# EAGLE board Open-Source_Control_V3_R0 (EAGLE 9.6.2), part 1 of 2
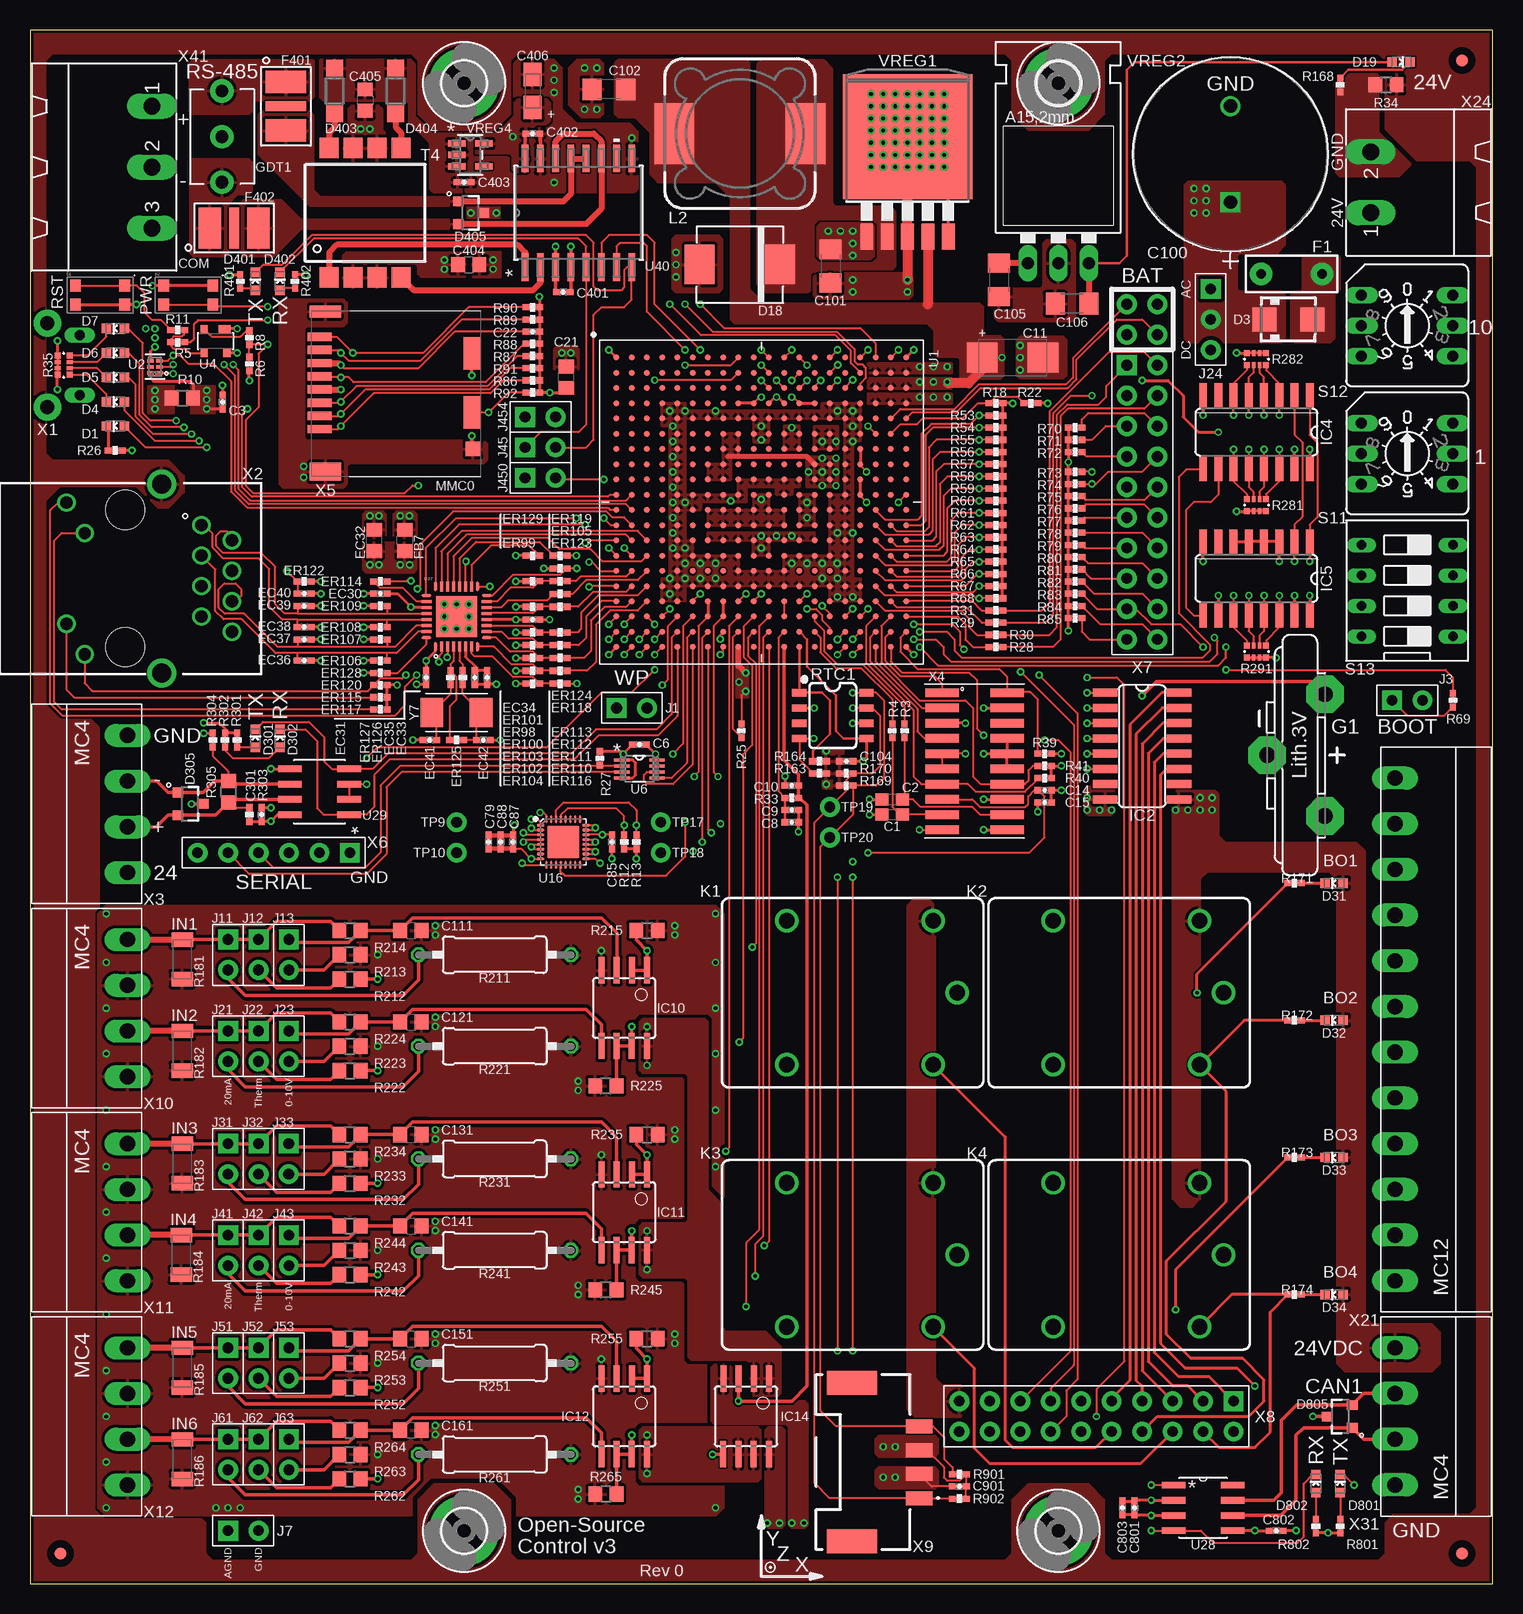
[diagram p7: board, top side]
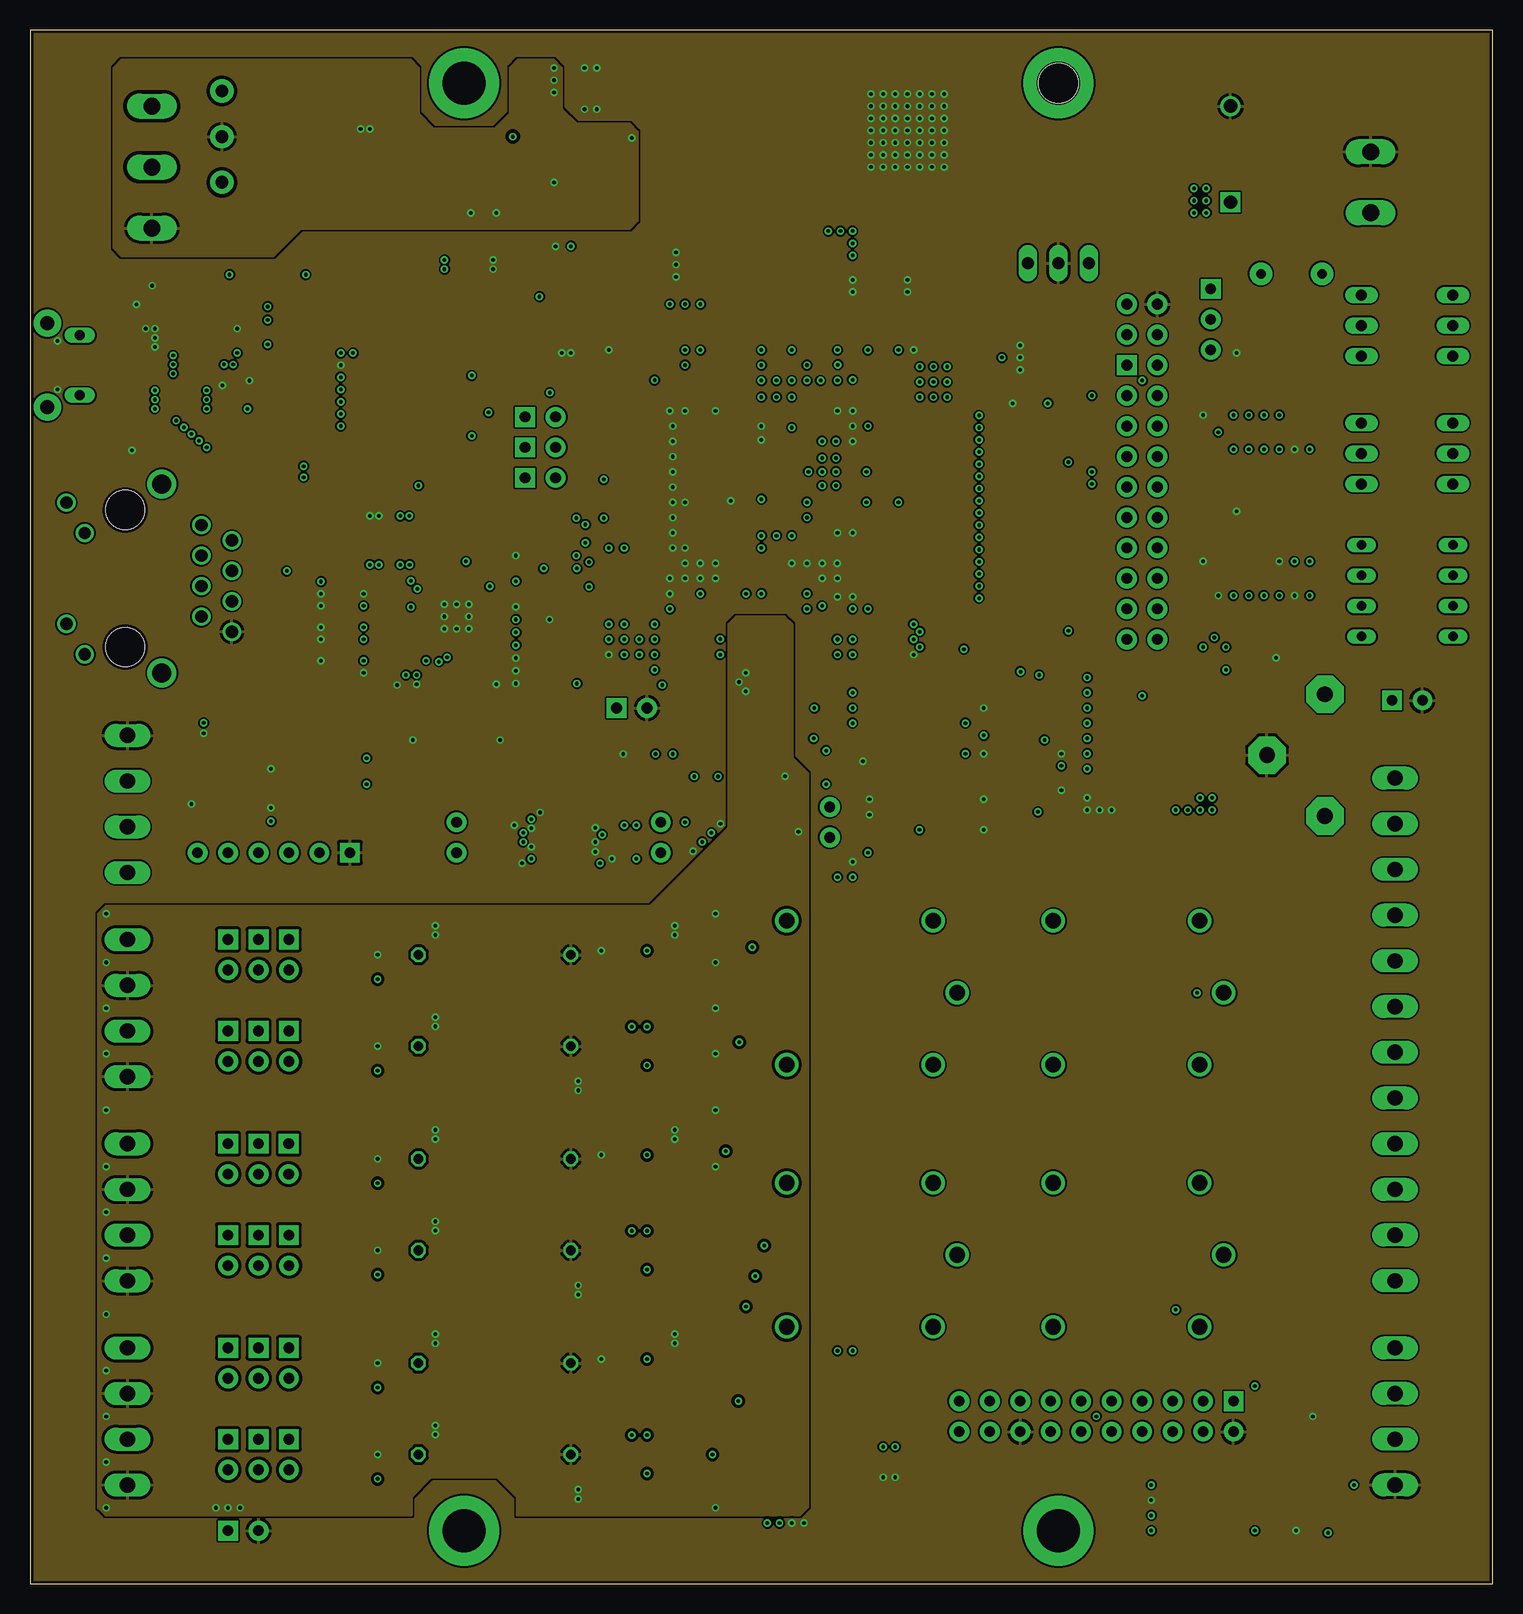
[diagram p8: board, inner layer Route2]
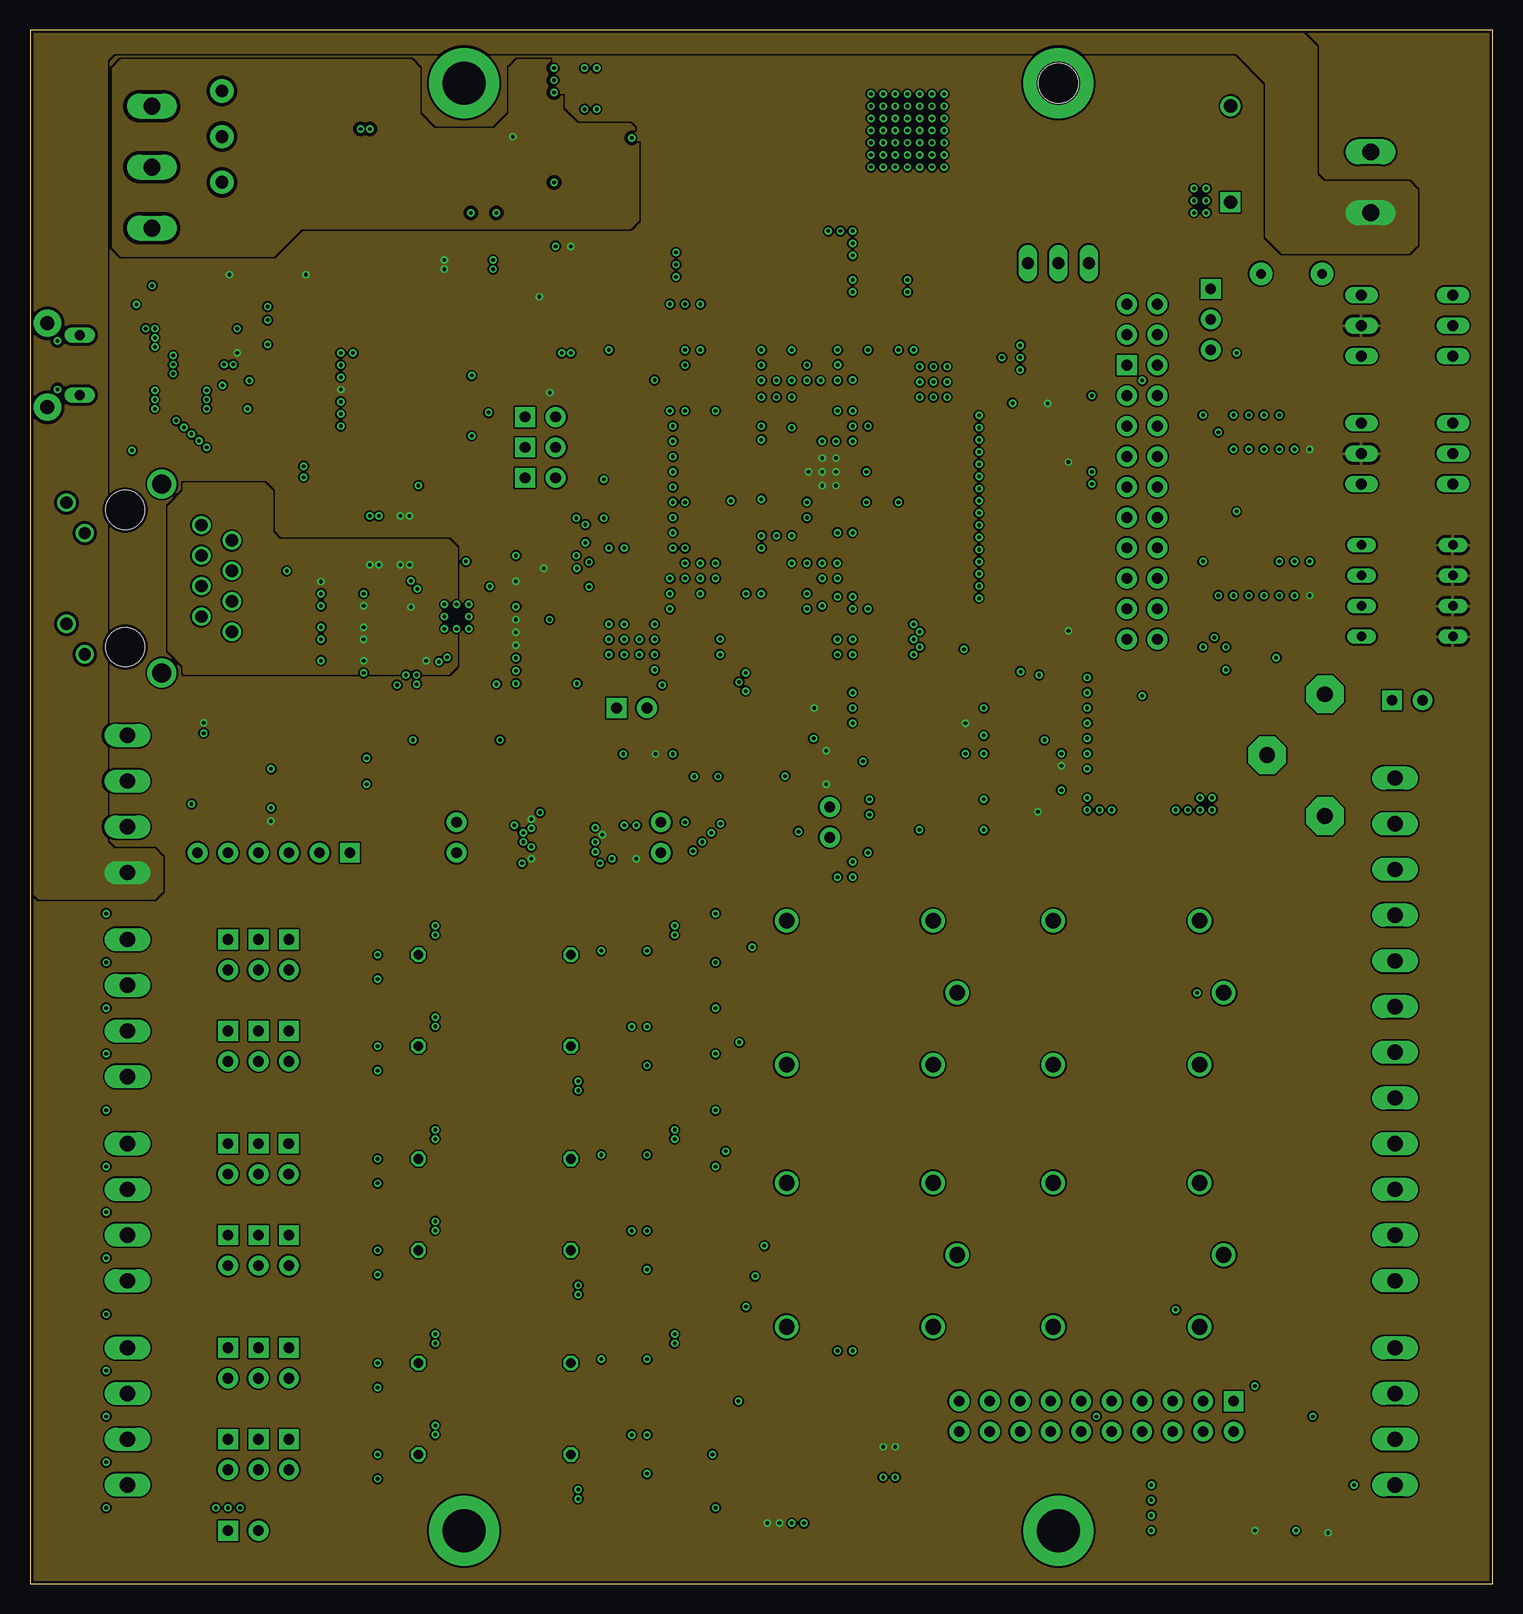
[diagram p9: board, inner layer Route15]
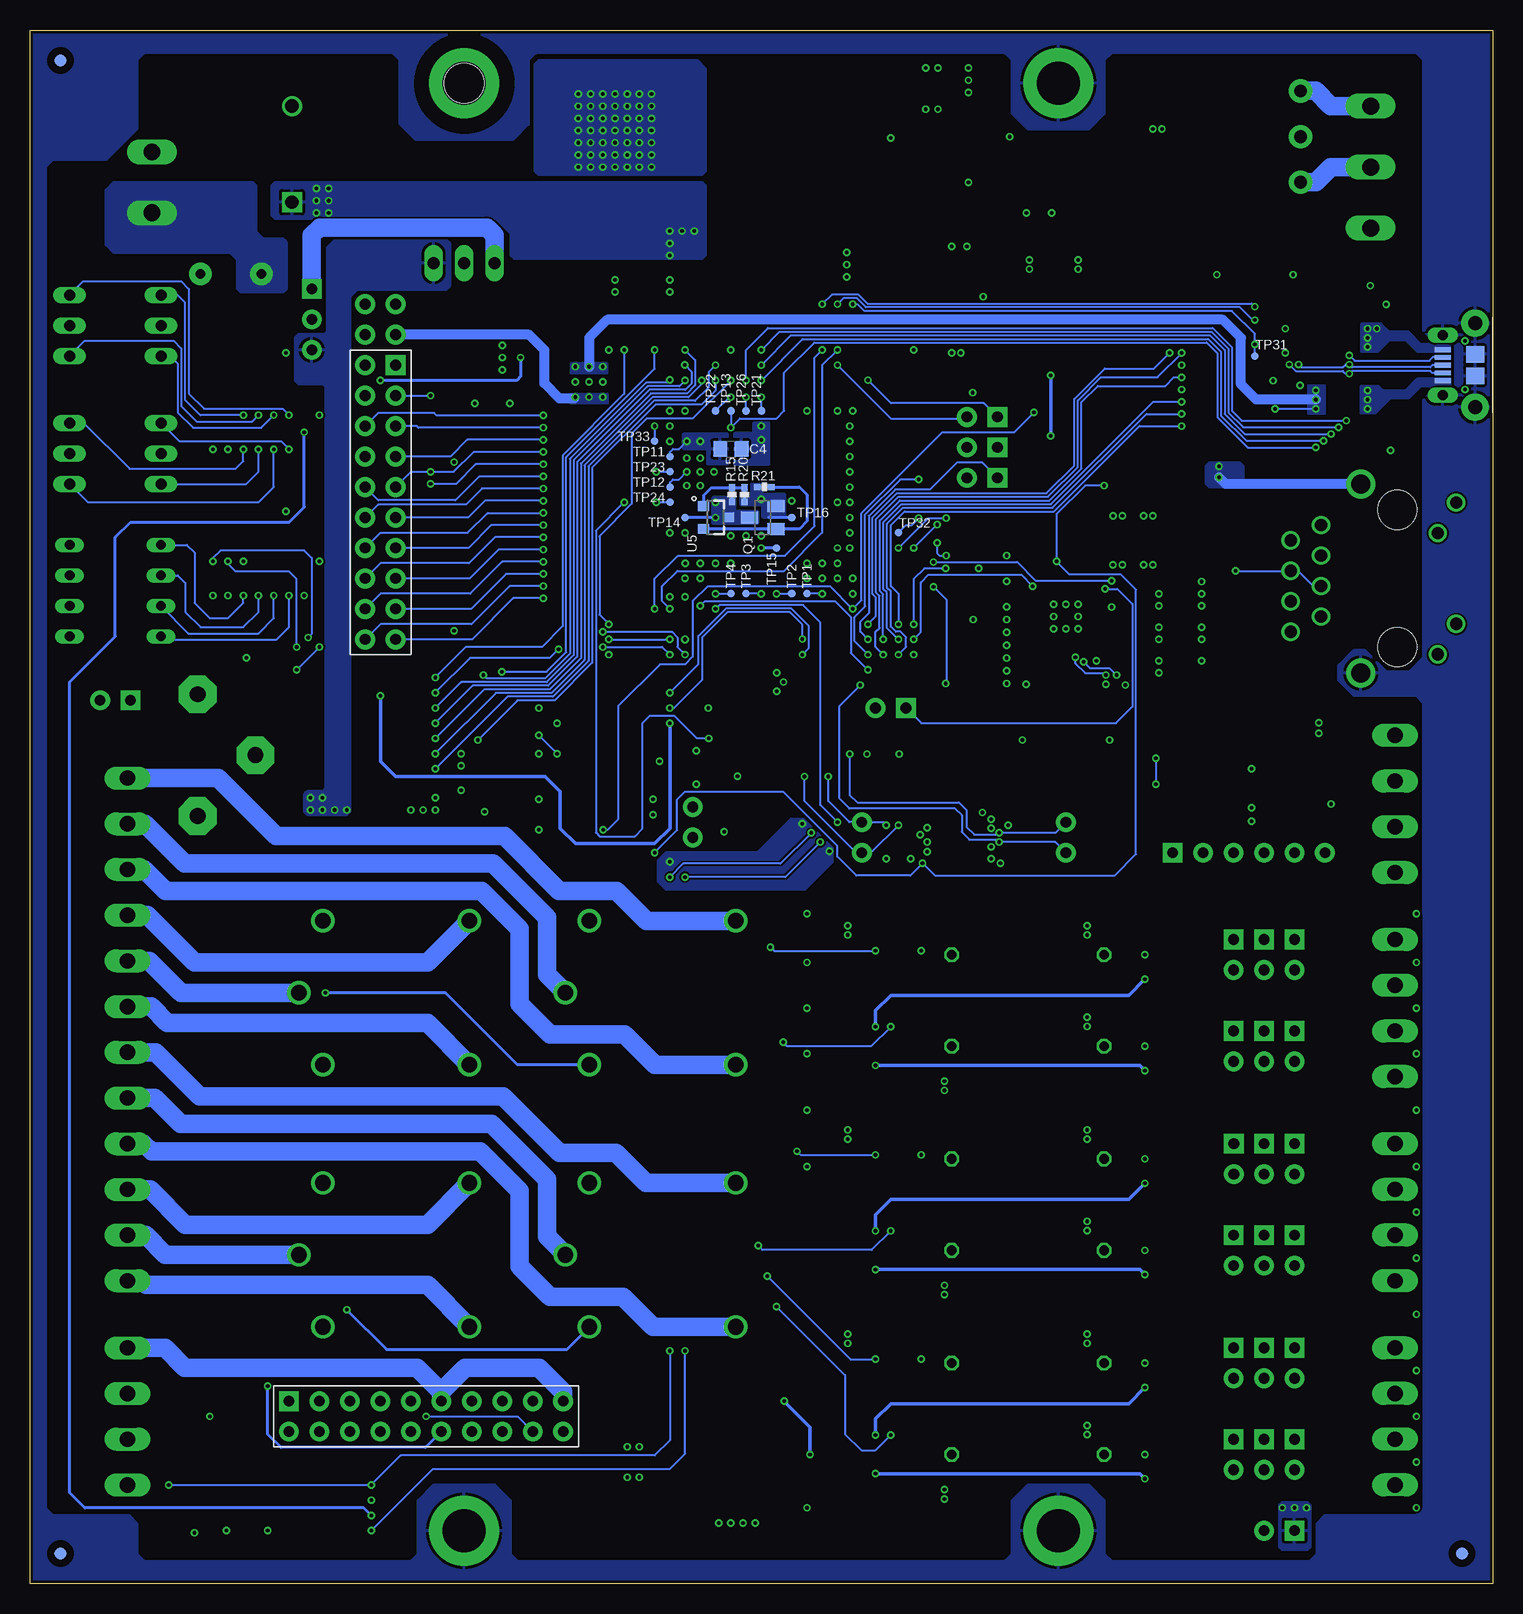
[diagram p10: board, bottom side, seen from below]

Size 121.92 x 129.54 mm. Coordinates in mm from the lower left corner, seen from the top.
Outline: 0,0 121.92,0 121.92,129.54 0,129.54 0,0
Copper layers (1*2*15*16): Top 0.035mm / dielectric 0.23mm / Route2 0.035mm / dielectric 0.93mm / Route15 0.035mm / dielectric 0.23mm / Bottom 0.035mm
Design rules "MF_Standard_4_Layer *": minimum track width 6mil, minimum drill 12mil, track to track 6mil, track to pad 6mil, pad to pad 6mil, via to via 6mil, smd to smd 0mil, copper to edge 10mil, drill to drill 10mil, minimum pad ring 6mil, minimum via ring 6mil, stop-mask expansion 2mil, vias tented up to drill 25mil, thermal gap 10mil
Net classes: 0 default: width 0.127 mm, drill 0.254 mm; 1 ground: width 0.152 mm, drill 0.254 mm, clearance 0.152 mm

## Footprints (pad centres in the part's own frame; a part is rotated, then mirrored left to right if it is on the bottom)
C0603 = smd 1.1 x 1: 1 -0.85,0; 2 0.85,0
C0402 = smd 0.61 x 0.508: 1 -0.559,0; 2 0.559,0
C0805 = smd 1.143 x 1.27: 1 -0.889,0; 2 0.889,0
C/6032-28R = smd 2.55 x 2.5: + 2.525,0; - -2.525,0
PCAP_16X25-THRU-ELECT = drill 1.118 pad 1.524 square: 1 -8.001,0 | drill 1.118 pad 1.524: 2 0,0
1206 = smd 1.6 x 1.8: 1 -1.4,0; 2 1.4,0
A/3216-18R = smd 1.95 x 1.5: + 1.375,0; - -1.375,0
EIA-STD = smd 0.787 x 0.787: 1 -0.749,0; 2 0.749,0
SMA = smd 2 x 2: A 2,0; C -2,0
SMC = smd 2.5 x 3.3: A 3.35,0; C -3.35,0
SOT23-3 = smd 0.8 x 0.9: 1 -0.95,-1; 2 0.95,-1; 3 0,1.1
SOD123 = smd 1.4 x 1.4: A 1.9,0; C -1.9,0
R0402 = smd 0.61 x 0.508: 1 -0.559,0; 2 0.559,0
PTH = drill 0.8 pad 1.88: P$1 -2.54,0; P$2 2.54,0
TBU-CA = smd 1.88 x 3.404: 1 -2.032,0; 3 2.032,0 | smd 0.813 x 3.404: 2 0,0
FIDUCIAL_40MIL = smd 1.016 x 1.016: P$1 0,0
CR2032V = drill 1.321 pad 3.15 octagon: + -2.54,-5.08; +@1 -2.54,5.08; - 2.286,0
2036-XX-B3 = drill 1.067 pad 1.93: 1 0,-3.81; 2 0,3.81; 3 0,0
SO16 = smd 0.66 x 2.032: 1 -4.445,-3.073; 2 -3.175,-3.073; 3 -1.905,-3.073; 4 -0.635,-3.073; 5 0.635,-3.073; 6 1.905,-3.073; 7 3.175,-3.073; 8 4.445,-3.073; 9 4.445,3.073; 10 3.175,3.073; 11 1.905,3.073; 12 0.635,3.073; 13 -0.635,3.073; 14 -1.905,3.073; 15 -3.175,3.073; 16 -4.445,3.073
SOIC8 = smd 0.5 x 2.2: 1 -1.905,-3.154; 2 -0.645,-3.154; 3 0.625,-3.154; 4 1.895,-3.154; 5 1.905,3.154; 6 0.635,3.154; 7 -0.635,3.154; 8 -1.905,3.154
H2-2.54 = drill 0.889 pad 1.651 square: 1 0,1.27 | drill 0.889 pad 1.651: 2 0,-1.27
H3-2.54 = drill 0.889 pad 1.651 square: 1 0,2.54 | drill 0.889 pad 1.651: 2 0,0; 3 0,-2.54
JS-M = drill 1.3: 1 6.7,6; 2 6.7,-6; C 8.7,0; NC -5.5,-6; NO -5.5,6
SRP1265 = smd 5.08 x 3.302: 1 0,5.461; 2 0,-5.461
3,6-PAD = drill 3.6 pad 5.842: B3,6 0,0
SOT23-BEC = smd 1 x 1.4: B -0.95,-1.1; C 0,1.1; E 0.95,-1.1
R0805 = smd 1.143 x 1.27: 1 -0.889,0; 2 0.889,0
RN0804 = smd 0.498 x 0.5: 1 -0.801,-0.5; 4 0.801,-0.5; 5 0.801,0.5; 8 -0.801,0.5 | smd 0.3 x 0.5: 2 -0.25,-0.5; 3 0.25,-0.5; 6 0.25,0.5; 7 -0.25,0.5
CT/CN1206 = smd 1.2 x 1.8: 1 -1.65,0; 2 1.65,0
0309/12 = drill 0.813 octagon: 1 -6.35,0; 2 6.35,0
SO08 = smd 0.6 x 1.2: 1 -1.905,-2.8; 2 -0.635,-2.8; 3 0.635,-2.8; 4 1.905,-2.8; 5 1.905,2.8; 6 0.635,2.8; 7 -0.635,2.8; 8 -1.905,2.8
SW4SMD_63X161LS = smd 0.9 x 1: 1 2.05,0.8; 2 2.05,-0.8; 3 -2.05,0.8; 4 -2.05,-0.8
P101 = drill 0.914 long: 1 3.81,-2.54; 2 -3.81,2.54; 4 3.81,2.54; 8 -3.81,-2.54; C 3.81,0; C1 -3.81,0
DS-04 = drill 0.813 long: 1 -3.81,-3.81; 2 -1.27,-3.81; 3 1.27,-3.81; 4 3.81,-3.81; 5 3.81,3.81; 6 1.27,3.81; 7 -1.27,3.81; 8 -3.81,3.81
DA230X-AL = smd 1.7 x 1.6: P$1 -5.4,3; P$2 -5.4,1; P$3 -5.4,-1; P$4 -5.4,-3; P$5 5.4,-3; P$6 5.4,-1; P$7 5.4,1; P$8 5.4,3
TP_B0,65 = smd 0.635 x 0.635: TP 0,0
TESTPAD/W_HOLE_1X1 = drill 0.889 pad 1.651: P$1 0,0
OSD335X-BGA-400 = smd 0.5 x 0.5: A1 -12.065,-12.065; A2 -12.065,-10.795; A3 -12.065,-9.525; A4 -12.065,-8.255; A5 -12.065,-6.985; A6 -12.065,-5.715; A7 -12.065,-4.445; A8 -12.065,-3.175; A9 -12.065,-1.905; A10 -12.065,-0.635; A11 -12.065,0.635; A12 -12.065,1.905; A13 -12.065,3.175; A14 -12.065,4.445; A15 -12.065,5.715; A16 -12.065,6.985; A17 -12.065,8.255; A18 -12.065,9.525; A19 -12.065,10.795; A20 -12.065,12.065; B1 -10.795,-12.065; B2 -10.795,-10.795; B3 -10.795,-9.525; B4 -10.795,-8.255; B5 -10.795,-6.985; B6 -10.795,-5.715; B7 -10.795,-4.445; B8 -10.795,-3.175; B9 -10.795,-1.905; B10 -10.795,-0.635; B11 -10.795,0.635; B12 -10.795,1.905; B13 -10.795,3.175; B14 -10.795,4.445; B15 -10.795,5.715; B16 -10.795,6.985; B17 -10.795,8.255; B18 -10.795,9.525; B19 -10.795,10.795; B20 -10.795,12.065; C1 -9.525,-12.065; C2 -9.525,-10.795; C3 -9.525,-9.525; C4 -9.525,-8.255; C5 -9.525,-6.985; C6 -9.525,-5.715; C7 -9.525,-4.445; C8 -9.525,-3.175; C9 -9.525,-1.905; C10 -9.525,-0.635; C11 -9.525,0.635; C12 -9.525,1.905; C13 -9.525,3.175; C14 -9.525,4.445; C15 -9.525,5.715; C16 -9.525,6.985; C17 -9.525,8.255; C18 -9.525,9.525; C19 -9.525,10.795; C20 -9.525,12.065; D1 -8.255,-12.065; D2 -8.255,-10.795; D3 -8.255,-9.525; D4 -8.255,-8.255; D5 -8.255,-6.985; D6 -8.255,-5.715; D7 -8.255,-4.445; D8 -8.255,-3.175; D9 -8.255,-1.905; D10 -8.255,-0.635; D11 -8.255,0.635; D12 -8.255,1.905; D13 -8.255,3.175; D14 -8.255,4.445; D15 -8.255,5.715; D16 -8.255,6.985; D17 -8.255,8.255; D18 -8.255,9.525; D19 -8.255,10.795; D20 -8.255,12.065; E1 -6.985,-12.065; E2 -6.985,-10.795; E3 -6.985,-9.525; E4 -6.985,-8.255; E5 -6.985,-6.985; E6 -6.985,-5.715; E7 -6.985,-4.445; E8 -6.985,-3.175; E9 -6.985,-1.905; E10 -6.985,-0.635; E11 -6.985,0.635; E12 -6.985,1.905; E13 -6.985,3.175; E14 -6.985,4.445; E15 -6.985,5.715; E16 -6.985,6.985; E17 -6.985,8.255; E18 -6.985,9.525; E19 -6.985,10.795; E20 -6.985,12.065; F1 -5.715,-12.065; F2 -5.715,-10.795; F3 -5.715,-9.525; F4 -5.715,-8.255; F5 -5.715,-6.985; F6 -5.715,-5.715; F7 -5.715,-4.445; F8 -5.715,-3.175; F9 -5.715,-1.905; F10 -5.715,-0.635; F11 -5.715,0.635; F12 -5.715,1.905; F13 -5.715,3.175; F14 -5.715,4.445; F15 -5.715,5.715; F16 -5.715,6.985; F17 -5.715,8.255; F18 -5.715,9.525; F19 -5.715,10.795; F20 -5.715,12.065; G1 -4.445,-12.065; G2 -4.445,-10.795; G3 -4.445,-9.525; G4 -4.445,-8.255; G5 -4.445,-6.985; G6 -4.445,-5.715; G7 -4.445,-4.445; G8 -4.445,-3.175; G9 -4.445,-1.905; G10 -4.445,-0.635; G11 -4.445,0.635; G12 -4.445,1.905; G13 -4.445,3.175; G14 -4.445,4.445; G15 -4.445,5.715; G16 -4.445,6.985; G17 -4.445,8.255; G18 -4.445,9.525; G19 -4.445,10.795; G20 -4.445,12.065; H1 -3.175,-12.065; H2 -3.175,-10.795; H3 -3.175,-9.525; H4 -3.175,-8.255; H5 -3.175,-6.985; H6 -3.175,-5.715; H7 -3.175,-4.445; H8 -3.175,-3.175; H9 -3.175,-1.905; H10 -3.175,-0.635; H11 -3.175,0.635; H12 -3.175,1.905; H13 -3.175,3.175; H14 -3.175,4.445; H15 -3.175,5.715; H16 -3.175,6.985; H17 -3.175,8.255; H18 -3.175,9.525; H19 -3.175,10.795; H20 -3.175,12.065; J1 -1.905,-12.065; J2 -1.905,-10.795; J3 -1.905,-9.525; J4 -1.905,-8.255; J5 -1.905,-6.985; J6 -1.905,-5.715; J7 -1.905,-4.445; J8 -1.905,-3.175; J9 -1.905,-1.905; J10 -1.905,-0.635; J11 -1.905,0.635; J12 -1.905,1.905; J13 -1.905,3.175; J14 -1.905,4.445; J15 -1.905,5.715; J16 -1.905,6.985; J17 -1.905,8.255; J18 -1.905,9.525; J19 -1.905,10.795; J20 -1.905,12.065; K1 -0.635,-12.065; K2 -0.635,-10.795; K3 -0.635,-9.525; K4 -0.635,-8.255; K5 -0.635,-6.985; K6 -0.635,-5.715; K7 -0.635,-4.445; K8 -0.635,-3.175; K9 -0.635,-1.905; K10 -0.635,-0.635; K11 -0.635,0.635; K12 -0.635,1.905; K13 -0.635,3.175; K14 -0.635,4.445; K15 -0.635,5.715; K16 -0.635,6.985; K17 -0.635,8.255; K18 -0.635,9.525; K19 -0.635,10.795; K20 -0.635,12.065; L1 0.635,-12.065; L2 0.635,-10.795; L3 0.635,-9.525; L4 0.635,-8.255; L5 0.635,-6.985; L6 0.635,-5.715; L7 0.635,-4.445; L8 0.635,-3.175; L9 0.635,-1.905; L10 0.635,-0.635; L11 0.635,0.635; L12 0.635,1.905; L13 0.635,3.175; L14 0.635,4.445; L15 0.635,5.715; L16 0.635,6.985; L17 0.635,8.255; L18 0.635,9.525; L19 0.635,10.795; L20 0.635,12.065; M1 1.905,-12.065; M2 1.905,-10.795; M3 1.905,-9.525; M4 1.905,-8.255; M5 1.905,-6.985; M6 1.905,-5.715; M7 1.905,-4.445; M8 1.905,-3.175; M9 1.905,-1.905; M10 1.905,-0.635; M11 1.905,0.635; M12 1.905,1.905; M13 1.905,3.175; M14 1.905,4.445; M15 1.905,5.715; M16 1.905,6.985; M17 1.905,8.255; M18 1.905,9.525; M19 1.905,10.795; M20 1.905,12.065; N1 3.175,-12.065; N2 3.175,-10.795; N3 3.175,-9.525; N4 3.175,-8.255; N5 3.175,-6.985; N6 3.175,-5.715; N7 3.175,-4.445; N8 3.175,-3.175; N9 3.175,-1.905; N10 3.175,-0.635; N11 3.175,0.635; N12 3.175,1.905; N13 3.175,3.175; N14 3.175,4.445; N15 3.175,5.715; N16 3.175,6.985; N17 3.175,8.255; N18 3.175,9.525; N19 3.175,10.795; N20 3.175,12.065; P1 4.445,-12.065; P2 4.445,-10.795; P3 4.445,-9.525; P4 4.445,-8.255; P5 4.445,-6.985; P6 4.445,-5.715; P7 4.445,-4.445; P8 4.445,-3.175; P9 4.445,-1.905; P10 4.445,-0.635; P11 4.445,0.635; P12 4.445,1.905; P13 4.445,3.175; P14 4.445,4.445; P15 4.445,5.715; P16 4.445,6.985; P17 4.445,8.255; P18 4.445,9.525; P19 4.445,10.795; P20 4.445,12.065; R1 5.715,-12.065; R2 5.715,-10.795; R3 5.715,-9.525; R4 5.715,-8.255; R5 5.715,-6.985; R6 5.715,-5.715; R7 5.715,-4.445; R8 5.715,-3.175; R9 5.715,-1.905; R10 5.715,-0.635; R11 5.715,0.635; R12 5.715,1.905; R13 5.715,3.175; R14 5.715,4.445; R15 5.715,5.715; R16 5.715,6.985; R17 5.715,8.255; R18 5.715,9.525; R19 5.715,10.795; R20 5.715,12.065; T1 6.985,-12.065; T2 6.985,-10.795; T3 6.985,-9.525; T4 6.985,-8.255; T5 6.985,-6.985; T6 6.985,-5.715; T7 6.985,-4.445; T8 6.985,-3.175; T9 6.985,-1.905; T10 6.985,-0.635; T11 6.985,0.635; T12 6.985,1.905; T13 6.985,3.175; T14 6.985,4.445; T15 6.985,5.715; T16 6.985,6.985; T17 6.985,8.255; T18 6.985,9.525; T19 6.985,10.795; T20 6.985,12.065; U1 8.255,-12.065; U2 8.255,-10.795; U3 8.255,-9.525; U4 8.255,-8.255; U5 8.255,-6.985; U6 8.255,-5.715; U7 8.255,-4.445; U8 8.255,-3.175; U9 8.255,-1.905; U10 8.255,-0.635; U11 8.255,0.635; U12 8.255,1.905; U13 8.255,3.175; U14 8.255,4.445; U15 8.255,5.715; U16 8.255,6.985; U17 8.255,8.255; U18 8.255,9.525; U19 8.255,10.795; U20 8.255,12.065; V1 9.525,-12.065; V2 9.525,-10.795; V3 9.525,-9.525; V4 9.525,-8.255; V5 9.525,-6.985; V6 9.525,-5.715; V7 9.525,-4.445; V8 9.525,-3.175; V9 9.525,-1.905; V10 9.525,-0.635; V11 9.525,0.635; V12 9.525,1.905; V13 9.525,3.175; V14 9.525,4.445; V15 9.525,5.715; V16 9.525,6.985; V17 9.525,8.255; V18 9.525,9.525; V19 9.525,10.795; V20 9.525,12.065; W1 10.795,-12.065; W2 10.795,-10.795; W3 10.795,-9.525; W4 10.795,-8.255; W5 10.795,-6.985; W6 10.795,-5.715; W7 10.795,-4.445; W8 10.795,-3.175; W9 10.795,-1.905; W10 10.795,-0.635; W11 10.795,0.635; W12 10.795,1.905; W13 10.795,3.175; W14 10.795,4.445; W15 10.795,5.715; W16 10.795,6.985; W17 10.795,8.255; W18 10.795,9.525; W19 10.795,10.795; W20 10.795,12.065; Y1 12.065,-12.065; Y2 12.065,-10.795; Y3 12.065,-9.525; Y4 12.065,-8.255; Y5 12.065,-6.985; Y6 12.065,-5.715; Y7 12.065,-4.445; Y8 12.065,-3.175; Y9 12.065,-1.905; Y10 12.065,-0.635; Y11 12.065,0.635; Y12 12.065,1.905; Y13 12.065,3.175; Y14 12.065,4.445; Y15 12.065,5.715; Y16 12.065,6.985; Y17 12.065,8.255; Y18 12.065,9.525; Y19 12.065,10.795; Y20 12.065,12.065
DRY6 = smd 0.55 x 0.3: 1 -0.355,0.5 | smd 0.52 x 0.3: 2 -0.37,0; 3 -0.37,-0.5; 4 0.37,-0.5; 5 0.37,0; 6 0.37,0.5
SOT143-R = smd 1 x 0.7: 1 -0.75,-1 | smd 0.6 x 0.7: 2 0.95,-1; 3 0.95,1; 4 -0.95,1
DCU8 = smd 1.27 x 0.254: 1 -1.473,0.749; 2 -1.473,0.249; 3 -1.473,-0.249; 4 -1.473,-0.749; 5 1.473,-0.749; 6 1.473,-0.249; 7 1.473,0.249; 8 1.473,0.749
QFN32-0.4-4X4MM = smd 0.6 x 0.2: 1 -1.9,1.4; 2 -1.9,1; 3 -1.9,0.6; 4 -1.9,0.2; 5 -1.9,-0.2; 6 -1.9,-0.6; 7 -1.9,-1; 8 -1.9,-1.4; 17 1.9,-1.4; 18 1.9,-1; 19 1.9,-0.6; 20 1.9,-0.2; 21 1.9,0.2; 22 1.9,0.6; 23 1.9,1; 24 1.9,1.4 | smd 0.2 x 0.6: 9 -1.4,-1.9; 10 -1,-1.9; 11 -0.6,-1.9; 12 -0.2,-1.9; 13 0.2,-1.9; 14 0.6,-1.9; 15 1,-1.9; 16 1.4,-1.9; 25 1.4,1.9; 26 1,1.9; 27 0.6,1.9; 28 0.2,1.9; 29 -0.2,1.9; 30 -0.6,1.9; 31 -1,1.9; 32 -1.4,1.9 | smd 2.7 x 2.7: 33 0,0
LAN8710A-QFN32 = smd 0.254 x 0.838: 1 -1.751,-2.515; 2 -1.251,-2.515; 3 -0.751,-2.515; 4 -0.251,-2.515; 5 0.251,-2.515; 6 0.751,-2.515; 7 1.251,-2.515; 8 1.751,-2.515; 17 1.751,2.515; 18 1.251,2.515; 19 0.751,2.515; 20 0.251,2.515; 21 -0.251,2.515; 22 -0.751,2.515; 23 -1.251,2.515; 24 -1.751,2.515 | smd 0.838 x 0.254: 9 2.515,-1.751; 10 2.515,-1.251; 11 2.515,-0.751; 12 2.515,-0.251; 13 2.515,0.251; 14 2.515,0.751; 15 2.515,1.251; 16 2.515,1.751; 25 -2.515,1.751; 26 -2.515,1.251; 27 -2.515,0.751; 28 -2.515,0.251; 29 -2.515,-0.251; 30 -2.515,-0.751; 31 -2.515,-1.251; 32 -2.515,-1.751 | smd 3.404 x 3.404: 33 0,0
BEAGLEBONE_BLUE_D8 = smd 1.981 x 0.559: 1 -2.464,1.905; 2 -2.464,0.635; 3 -2.464,-0.635; 4 -2.464,-1.905; 5 2.464,-1.905; 6 2.464,-0.635; 7 2.464,0.635; 8 2.464,1.905
21-0041B_8 = smd 1.981 x 0.533: 1 -2.464,1.905; 2 -2.464,0.635; 3 -2.464,-0.635; 4 -2.464,-1.905; 5 2.464,-1.905; 6 2.464,-0.635; 7 2.464,0.635; 8 2.464,1.905
DW16 = smd 2.311 x 0.559: 1 -4.521,4.445; 2 -4.521,3.175; 3 -4.521,1.905; 4 -4.521,0.635; 5 -4.521,-0.635; 6 -4.521,-1.905; 7 -4.521,-3.175; 8 -4.521,-4.445; 9 4.521,-4.445; 10 4.521,-3.175; 11 4.521,-1.905; 12 4.521,-0.635; 13 4.521,0.635; 14 4.521,1.905; 15 4.521,3.175; 16 4.521,4.445
TO263-5 = smd 1.067 x 2.159: 1 -3.404,-5.791; 2 -1.702,-5.791; 3 0,-5.791; 4 1.702,-5.791; 5 3.404,-5.791 | smd 10.8 x 10.41: 6 0,2.54
78XXL = drill 1.016 long: GND 0,-3.81; IN -2.54,-3.81; OUT 2.54,-3.81 | hole 3.302: 0,11.176
DBV5 = smd 1.473 x 0.559: 1 -1.118,0.95; 2 -1.118,0; 3 -1.118,-0.95; 4 1.118,-0.95; 5 1.118,0.95
10118194-0001LF(MICRO-USB-B-AMPHENOL-FCI) = drill 1.15 pad 2.286: CGND1 0,3.5; CGND4 0,-3.5 | smd 1.5 x 1.35: CGND2 0,0.9; CGND3 0,-0.9 | drill 0.85 long: CGND5 2.7,-2.5; CGND6 2.7,2.5 | smd 1.35 x 0.4: D+ 2.7,0; D- 2.7,0.65; GND 2.7,-1.3; ID 2.7,-0.65; VBUS 2.7,1.3
J0011D01BNL = drill 1.016 pad 1.524: 1 4.445,-6.413; 2 3.175,-8.954; 3 1.905,-6.413; 4 0.635,-8.954; 5 -0.635,-6.413; 6 -1.905,-8.954; 7 -3.175,-6.413; 8 -4.445,-8.954; 9 6.325,4.839; 10 3.785,3.315; 11 -3.785,4.839; 12 -6.325,3.315 | drill 1.6 pad 2.286: S1 -7.874,-3.111; S2 7.874,-3.111 | hole 3.251: -5.715,-0.064; 5.715,-0.064
MC4 = drill 1.27 long: 1 -5.715,0; 2 -1.905,0; 3 1.905,0; 4 5.715,0
CTI-JTAG = smd 2.794 x 0.711: 1 -2.705,5.715; 2 2.705,5.715; 3 -2.705,4.445; 4 2.705,4.445; 5 -2.705,3.175; 6 2.705,3.175; 7 -2.705,1.905; 8 2.705,1.905; 9 -2.705,0.635; 10 2.705,0.635; 11 -2.705,-0.635; 12 2.705,-0.635; 13 -2.705,-1.905; 14 2.705,-1.905; 15 -2.705,-3.175; 16 2.705,-3.175; 17 -2.705,-4.445; 18 2.705,-4.445; 19 -2.705,-5.715; 20 2.705,-5.715
DM3CS-SF = smd 0.7 x 2: 1 0,0; 2 -1.1,0; 3 -2.2,0; 4 -3.3,0; 5 -4.4,0; 6 -5.5,0; 7 -6.6,0; 8 -7.7,0 | smd 1 x 2.6: 9 -9.8,0.5 | smd 1.5 x 2.6: 10 3.55,0.5 | smd 1.2 x 1.2: 11 1.65,12.8 | smd 2.7 x 1.4: 12 -1.4,12.7; 13 -6.3,12.7
H6-2.54 = drill 0.889 pad 1.651 square: 1 0,6.35 | drill 0.889 pad 1.651: 2 0,3.81; 3 0,1.27; 4 0,-1.27; 5 0,-3.81; 6 0,-6.35
H2X10-2.54 = drill 0.889 pad 1.651 square: 1 -1.27,11.43 | drill 0.889 pad 1.651: 2 1.27,11.43; 3 -1.27,8.89; 4 1.27,8.89; 5 -1.27,6.35; 6 1.27,6.35; 7 -1.27,3.81; 8 1.27,3.81; 9 -1.27,1.27; 10 1.27,1.27; 11 -1.27,-1.27; 12 1.27,-1.27; 13 -1.27,-3.81; 14 1.27,-3.81; 15 -1.27,-6.35; 16 1.27,-6.35; 17 -1.27,-8.89; 18 1.27,-8.89; 19 -1.27,-11.43; 20 1.27,-11.43
5600200420 = smd 1.168 x 2.184: P$1 2.997,8.585; P$2 0.991,8.585; P$3 -0.991,8.585; P$4 -2.997,8.585 | smd 1.981 x 4.191: P$5 -6.604,2.997; P$6 6.604,2.997
MC12 = drill 1.27 long: 1 -19.05,0; 2 -15.24,0; 3 -11.43,0; 4 -7.62,0; 5 -3.81,0; 6 0,0; 7 3.81,0; 8 7.62,0; 9 11.43,0; 10 15.24,0; 11 19.05,0; 12 22.86,0
MSTBA2 = drill 1.397 long: 1 -2.54,5.08; 2 2.54,5.08
MSTBA3 = drill 1.397 long: 1 -5.08,5.08; 2 0,5.08; 3 5.08,5.08
XTAL_2-SMD(5X3.2MM) = smd 1.905 x 2.413: P$1 2.057,0; P$2 -2.057,0

## Placement (x,y rotation side)
C1  DNI  [C0603]  71.88,64.14 0 top
C2  DNI  [C0603]  71.88,65.41 0 top
C3  0.1uF, 6.3V  [C0402]  16.05,98.53 90 top
C4  47uF  [C0805]  63.5,94.61 0 bottom
C6  0.1uF, 6.3V  [C0402]  50.8,69.98 0 top
C8  1nF  [C0402]  63.5,63.5 0 top
C9  0.1uF, 6.3V  [C0402]  63.5,64.52 0 top
C10  0.1uF, 6.3V  [C0402]  63.5,66.55 180 top
C11  220uF, 6.3V, T491C227K006AT  [C/6032-28R]  81.92,102.23 180 top
C14  0.1uF, 6.3V  [C0402]  84.58,66.17 0 top
C15  0.1uF, 6.3V  [C0402]  84.58,65.15 0 top
C21  10uF, 10V  [C0805]  44.7,100.58 90 top
C22  0.1uF, 6.3V  [C0402]  41.91,104.39 180 top
C79  0.1uF, 6.3V  [C0402]  38.23,61.85 90 top
C85  2200pF, 6.3V  [C0402]  48.51,61.85 270 top
C87  2200pF, 6.3V  [C0402]  40.26,61.85 90 top
C88  2200pF, 6.3V  [C0402]  39.24,61.85 90 top
C100  1000uF, 50V, UHE1H102MHD6  [PCAP_16X25-THRU-ELECT]  100.08,123.19 90 top
C101  0.47uF, 100V, X7R  [1206]  66.73,109.86 270 top
C102  0.47uF, 100V, X7R  [1206]  48.26,124.59 180 top
C104  0.1uF, 6.3V  [C0402]  68.05,68.58 0 top
C105  0.47uF, 100V, X7R  [1206]  80.77,108.71 270 top
C106  0.1uF, 50V  [1206]  86.87,106.73 180 top
C111  1uF  [C0805]  31.75,54.48 0 top
C121  1uF  [C0805]  31.75,46.86 0 top
C131  1uF  [C0805]  31.75,37.47 0 top
C141  1uF  [C0805]  31.75,29.84 0 top
C151  1uF  [C0805]  31.75,20.45 0 top
C161  1uF  [C0805]  31.75,12.83 0 top
C301  0.1uF, 6.3V  [C0402]  19.3,64.14 90 top
C401  0.1uF, 16V  [C0402]  44.45,107.7 180 top
C402  0.1uF, 16V  [C0402]  41.91,120.9 0 top
C403  0.1uF, 16V  [C0402]  36.2,116.84 0 top
C404  10uF, 16V  [C0805]  36.58,109.98 0 top
C405  10uF, 16V  [C0805]  27.94,123.7 270 top
C406  4.7uF, 16V, T491A475K016AT  [A/3216-18R]  41.91,124.46 270 top
C801  0.1uF, 6.3V  [C0402]  92.08,6.35 90 top
C802  0.1uF, 6.3V  [C0402]  103.89,4.45 0 top
C803  4.7uF, 6.3V  [C0402]  91.06,6.35 90 top
C901  0.1uF, 6.3V  [C0402]  77.47,8.13 180 top
D1  LTST-C191KGKT  [EIA-STD]  7.11,96.52 180 top
D3  S1D  [SMA]  104.88,105.41 0 top
D4  LTST-C191KGKT  [EIA-STD]  7.11,98.55 180 top
D5  LTST-C191KGKT  [EIA-STD]  7.11,100.58 180 top
D6  LTST-C191KGKT  [EIA-STD]  7.11,102.62 180 top
D7  LTST-C191KGKT  [EIA-STD]  7.11,104.65 180 top
D18  B550C-13-F  [SMC]  59.18,109.98 180 top
D19  LTST-C191KGKT  [EIA-STD]  114.3,126.87 0 top
D31  LTST-C191KGKT  [EIA-STD]  108.71,58.42 180 top
D32  LTST-C191KGKT  [EIA-STD]  108.71,46.99 180 top
D33  LTST-C191KGKT  [EIA-STD]  108.71,35.56 180 top
D34  LTST-C191KGKT  [EIA-STD]  108.71,24.13 180 top
D301  LTST-C191KRKT  [EIA-STD]  18.8,70.48 90 top
D302  LTST-C191KGKT  [EIA-STD]  20.83,70.48 90 top
D305  SM712  [SOT23-3]  13.34,65.02 270 top
D401  LTST-C191KRKT  [EIA-STD]  18.8,108.58 90 top
D402  LTST-C191KGKT  [EIA-STD]  20.83,108.58 90 top
D403  MBR0520LT  [SOD123]  25.4,124.46 270 top
D404  MBR0520LT  [SOD123]  30.48,124.46 270 top
D405  SM712  [SOT23-3]  36.7,114.3 270 top
D801  LTST-C191KRKT  [EIA-STD]  109.22,8.38 90 top
D802  LTST-C191KGKT  [EIA-STD]  107.19,8.38 90 top
D805  CDSOT23-T24CAN  [SOT23-3]  109.22,13.97 90 top
EC30  0.1uF, 6.3V  [C0402]  29.21,82.55 180 top
EC31  0.1uF, 6.3V  [C0402]  33.02,75.56 270 top
EC32  10uF, 10V  [C0805]  28.7,87 90 top
EC33  1uF, 10V  [C0402]  38.1,75.56 270 top
EC34  0.1uF, 6.3V  [C0402]  41.91,80.39 0 top
EC35  470pF, 6.3V  [C0402]  37.08,75.56 270 top
EC36  15pF, DNI  [C0402]  22.86,76.96 0 top
EC37  15pF, DNI  [C0402]  22.86,78.74 0 top
EC38  15pF, DNI  [C0402]  22.86,79.76 0 top
EC39  15pF, DNI  [C0402]  22.86,81.53 0 top
EC40  0.022uF, 10V  [C0402]  22.86,82.55 0 top
EC41  30pF, 50V  [C0402]  33.32,70.36 180 top
EC42  30pF, 50V  [C0402]  37.8,70.36 0 top
ER98  1.5K, 1%  [R0402]  41.91,79.32 0 top
ER99  1.5K, 1%  [R0402]  41.91,83.59 0 top
ER100  1.5K, 1%  [R0402]  41.91,78.26 0 top
ER101  10K, 1%  [R0402]  41.91,81.46 180 top
ER102  10K, 1%  [R0402]  41.91,76.12 180 top
ER103  10K, 1%  [R0402]  41.91,77.19 180 top
ER104  10K, 1%  [R0402]  41.91,75.06 180 top
ER105  1.5K, 1%  [R0402]  44.2,84.66 0 top
ER106  49.9, 1%  [R0402]  29.21,76.96 0 top
ER107  49.9, 1%  [R0402]  29.21,78.74 0 top
ER108  49.9, 1%  [R0402]  29.21,79.76 0 top
ER109  49.9, 1%  [R0402]  29.21,81.53 0 top
ER110  100, 1%  [R0402]  44.2,76.12 0 top
ER111  100, 1%  [R0402]  44.2,77.19 0 top
ER112  100, 1%  [R0402]  44.2,78.26 0 top
ER113  100, 1%  [R0402]  44.2,79.32 0 top
ER114  100, 1%  [R0402]  29.21,83.57 0 top
ER115  470, 1%  [R0402]  29.21,73.91 180 top
ER116  100, 1%  [R0402]  44.2,75.06 0 top
ER117  470, 1%  [R0402]  29.21,72.9 180 top
ER118  100, 1%  [R0402]  44.2,81.46 0 top
ER119  100, 1%  [R0402]  44.2,85.72 0 top
ER120  10K, 1%  [R0402]  29.21,74.93 180 top
ER122  0, 1%  [R0402]  22.86,83.57 180 top
ER123  100, 1%  [R0402]  44.2,83.59 0 top
ER124  100, 1%  [R0402]  44.2,82.52 0 top
ER125  1M, 1%, DNI  [R0402]  35.56,70.36 0 top
ER126  0, 1%  [R0402]  36.07,75.56 270 top
ER127  10, 1%  [R0402]  35.05,75.56 270 top
ER128  12.1K, 1%  [R0402]  29.21,75.95 0 top
ER129  10K, 1%  [R0402]  41.91,85.72 180 top
F1  60V, 750mA, R075  [PTH]  105.16,109.22 0 top
F401  TBU-CA085-300-WH  [TBU-CA]  21.34,123.19 270 top
F402  TBU-CA085-300-WH  [TBU-CA]  17.02,113.03 0 top
FB7  150ohm, 800mA  [C0805]  31.24,87 270 top
FUD1  FIDUCIAL  [FIDUCIAL_40MIL]  119.38,2.54 0 top
FUD2  FIDUCIAL  [FIDUCIAL_40MIL]  119.38,127 0 top
FUD3  FIDUCIAL  [FIDUCIAL_40MIL]  2.54,2.54 0 top
FUD4  FIDUCIAL  [FIDUCIAL_40MIL]  119.38,127 90 bottom
FUD5  FIDUCIAL  [FIDUCIAL_40MIL]  2.54,2.54 90 bottom
FUD6  FIDUCIAL  [FIDUCIAL_40MIL]  119.38,2.54 90 bottom
G1  CR2032V  [CR2032V]  105.41,69.09 180 top
GDT1  2036-07-B3  [2036-XX-B3]  16,120.65 0 top
IC2  ULN2003AD  [SO16]  92.71,69.85 270 top
IC4  74HC165D  [SO16]  102.23,96.01 180 top
IC5  74HC165D  [SO16]  102.23,83.82 180 top
IC10  MCP6002SMT  [SOIC8]  49.53,48.01 180 top
IC11  MCP6002SMT  [SOIC8]  49.53,30.99 180 top
IC12  MCP6002SMT  [SOIC8]  49.53,13.97 180 top
IC14  MCP6002SMT  [SOIC8]  59.69,13.97 180 top
J1  [H2-2.54]  50.16,73.03 90 top
J3  [H2-2.54]  114.81,73.66 90 top
J7  [H2-2.54]  17.78,4.45 90 top
J11  [H2-2.54]  16.51,52.45 0 top
J12  [H2-2.54]  19.05,52.45 0 top
J13  [H2-2.54]  21.59,52.45 0 top
J21  [H2-2.54]  16.51,44.83 0 top
J22  [H2-2.54]  19.05,44.83 0 top
J23  [H2-2.54]  21.59,44.83 0 top
J24  6p-2.54  [H3-2.54]  98.42,105.41 0 top
J31  [H2-2.54]  16.51,35.43 0 top
J32  [H2-2.54]  19.05,35.43 0 top
J33  [H2-2.54]  21.56,35.43 0 top
J41  [H2-2.54]  16.51,27.81 0 top
J42  [H2-2.54]  19.05,27.81 0 top
J43  [H2-2.54]  21.59,27.81 0 top
J45  [H2-2.54]  42.55,94.74 90 top
J51  [H2-2.54]  16.51,18.41 0 top
J52  [H2-2.54]  19.05,18.41 0 top
J53  [H2-2.54]  21.59,18.41 0 top
J61  [H2-2.54]  16.51,10.79 0 top
J62  [H2-2.54]  19.05,10.79 0 top
J63  [H2-2.54]  21.59,10.79 0 top
J450  [H2-2.54]  42.55,92.2 90 top
J454  [H2-2.54]  42.55,97.28 90 top
K1  G5LE-14-CF DC24  [JS-M]  68.58,49.28 0 top
K2  G5LE-14-CF DC24  [JS-M]  90.81,49.28 0 top
K3  G5LE-14-CF DC24  [JS-M]  68.58,27.43 0 top
K4  G5LE-14-CF DC24  [JS-M]  90.81,27.43 0 top
L2  SRP1265A-470M  [SRP1265]  59.18,120.9 270 top
MTG1  MOUNT-PAD-ROUND3.6  [3,6-PAD]  36.2,4.45 0 top
MTG2  MOUNT-PAD-ROUND3.6  [3,6-PAD]  85.72,4.45 0 top
MTG3  MOUNT-PAD-ROUND3.6  [3,6-PAD]  36.2,125.09 0 top
MTG4  MOUNT-PAD-ROUND3.6  [3,6-PAD]  85.72,125.09 0 top
Q1  MMBT2907  [SOT23-BEC]  60.83,88.9 90 bottom
R3  0, 1%  [R0402]  72.9,71.12 270 top
R4  0, 1%  [R0402]  71.88,71.12 270 top
R5  0  [R0402]  12.32,103.5 180 top
R6  100K, DNI  [R0402]  18.29,101.7 90 top
R8  1K  [R0402]  18.29,103.89 90 top
R10  0, 1%  [R0805]  12.7,98.86 0 top
R11  0  [R0402]  12.32,104.52 0 top
R12  1.5K, 1%  [R0402]  49.53,61.85 270 top
R13  1.5K, 1%  [R0402]  50.55,61.85 270 top
R15  40.2K  [R0402]  63.4,90.81 90 bottom
R18  4.75K, 1%  [R0402]  80.52,98.42 180 top
R20  10K  [R0402]  62.36,90.81 270 bottom
R21  499  [R0402]  60.71,91.44 180 bottom
R22  4.75K, 1%  [R0402]  83.44,98.42 0 top
R25  0, 1%  [R0402]  59.31,71.12 90 top
R26  1.5K, 1%  [R0402]  7.11,94.49 0 top
R27  100K, 1%  [R0402]  47.5,68.83 270 top
R28  0, 1%  [R0402]  80.52,78.11 0 top
R29  0, 1%  [R0402]  80.52,80.14 0 top
R30  0, 1%  [R0402]  80.52,79.12 0 top
R31  22, 1%  [R0402]  80.52,81.15 0 top
R33  0, 1%  [R0402]  63.5,65.53 0 top
R34  .1, 0805  [R0805]  113.03,124.97 0 top
R35  1K  [RN0804]  2.79,101.6 270 top
R39  4.75K, 1%  [R0402]  84.58,69.22 180 top
R40  4.75K, 1%  [R0402]  84.58,67.18 0 top
R41  4.75K, 1%  [R0402]  84.58,68.2 0 top
R53  100K, 1%  [R0402]  80.52,97.41 180 top
R54  100K, 1%, DNI  [R0402]  80.52,96.39 180 top
R55  100K, 1%  [R0402]  80.52,95.38 180 top
R56  100K, 1%  [R0402]  80.52,94.36 180 top
R57  100K, 1%  [R0402]  80.52,93.34 180 top
R58  100K, 1%  [R0402]  80.52,92.33 180 top
R59  100K, 1%  [R0402]  80.52,91.31 180 top
R60  100K, 1%  [R0402]  80.52,90.3 180 top
R61  100K, 1%  [R0402]  80.52,89.28 180 top
R62  100K, 1%  [R0402]  80.52,88.27 180 top
R63  100K, 1%  [R0402]  80.52,87.25 180 top
R64  100K, 1%, DNI  [R0402]  80.52,86.23 180 top
R65  100K, 1%, DNI  [R0402]  80.52,85.22 180 top
R66  100K, 1%, DNI  [R0402]  80.52,84.2 180 top
R67  100K, 1%  [R0402]  80.52,83.19 180 top
R68  100K, 1%  [R0402]  80.52,82.17 180 top
R69  100, 1%  [R0402]  118.62,73.66 270 top
R70  100K, 1%, DNI  [R0402]  87.12,96.39 180 top
R71  100K, 1%  [R0402]  87.12,95.38 180 top
R72  100K, 1%, DNI  [R0402]  87.12,94.36 180 top
R73  100K, 1%, DNI  [R0402]  87.12,92.71 180 top
R74  100K, 1%, DNI  [R0402]  87.12,91.69 180 top
R75  100K, 1%, DNI  [R0402]  87.12,90.68 180 top
R76  100K, 1%, DNI  [R0402]  87.12,89.66 180 top
R77  100K, 1%, DNI  [R0402]  87.12,88.65 180 top
R78  100K, 1%, DNI  [R0402]  87.12,87.63 180 top
R79  100K, 1%, DNI  [R0402]  87.12,86.61 180 top
R80  100K, 1%, DNI  [R0402]  87.12,85.6 180 top
R81  100K, 1%  [R0402]  87.12,84.58 180 top
R82  100K, 1%  [R0402]  87.12,83.57 180 top
R83  100K, 1%  [R0402]  87.12,82.55 180 top
R84  100K, 1%, DNI  [R0402]  87.12,81.53 180 top
R85  100K, 1%, DNI  [R0402]  87.12,80.52 180 top
R86  10K, 1%  [R0402]  41.91,100.33 0 top
R87  10K, 1%  [R0402]  41.91,102.36 0 top
R88  10K, 1%  [R0402]  41.91,103.38 0 top
R89  10K, 1%  [R0402]  41.91,105.41 0 top
R90  10K, 1%  [R0402]  41.91,106.43 0 top
R91  10K, 1%  [R0402]  41.91,101.35 0 top
R92  10K, 1%  [R0402]  41.91,99.31 0 top
R163  100K, DNI  [R0402]  65.81,67.56 0 top
R164  1.5K, 1%  [R0402]  65.81,68.58 180 top
R168  10K  [R0402]  109.22,124.97 270 top
R169  10K, 1%  [R0402]  68.05,66.55 180 top
R170  10K, 1%  [R0402]  68.05,67.56 180 top
R171  10K  [R0402]  105.41,58.42 180 top
R172  10K  [R0402]  105.41,46.99 180 top
R173  10K  [R0402]  105.41,35.56 180 top
R174  10K  [R0402]  105.41,24.13 180 top
R181  B72520T0300K062  [CT/CN1206]  12.7,52.07 270 top
R182  B72520T0300K062  [CT/CN1206]  12.7,44.45 270 top
R183  B72520T0300K062  [CT/CN1206]  12.7,35.05 270 top
R184  B72520T0300K062  [CT/CN1206]  12.62,27.43 270 top
R185  B72520T0300K062  [CT/CN1206]  12.7,18.03 270 top
R186  B72520T0300K062  [CT/CN1206]  12.7,10.41 270 top
R211  80, 0.1%  [0309/12]  38.73,52.45 180 top
R212  10K, 1%  [R0805]  26.67,50.42 0 top
R213  2K, 1%  [R0805]  26.67,52.45 0 top
R214  10K, 1%  [R0805]  26.67,54.48 0 top
R215  100K  [R0805]  51.44,54.48 0 top
R221  80, 0.1%  [0309/12]  38.73,44.83 180 top
R222  10K, 1%  [R0805]  26.67,42.8 0 top
R223  2K, 1%  [R0805]  26.67,44.83 0 top
R224  10K, 1%  [R0805]  26.67,46.86 0 top
R225  100K  [R0805]  48.01,41.53 180 top
R231  80, 0.1%  [0309/12]  38.73,35.43 180 top
R232  10K, 1%  [R0805]  26.67,33.4 0 top
R233  2K, 1%  [R0805]  26.67,35.43 0 top
R234  10K, 1%  [R0805]  26.67,37.47 0 top
R235  100K  [R0805]  51.44,37.47 0 top
R241  80, 0.1%  [0309/12]  38.73,27.81 180 top
R242  10K, 1%  [R0805]  26.67,25.78 0 top
R243  2K, 1%  [R0805]  26.67,27.81 0 top
R244  10K, 1%  [R0805]  26.67,29.84 0 top
R245  100K  [R0805]  48.01,24.51 180 top
R251  80, 0.1%  [0309/12]  38.73,18.41 180 top
R252  10K, 1%  [R0805]  26.67,16.38 0 top
R253  2K, 1%  [R0805]  26.67,18.41 0 top
R254  10K, 1%  [R0805]  26.67,20.45 0 top
R255  100K  [R0805]  51.44,20.45 0 top
R261  80, 0.1%  [0309/12]  38.73,10.79 180 top
R262  10K, 1%  [R0805]  26.67,8.76 0 top
R263  2K, 1%  [R0805]  26.67,10.79 0 top
R264  10K, 1%  [R0805]  26.67,12.83 0 top
R265  100K  [R0805]  48.01,7.49 180 top
R281  10K  [RN0804]  102.23,89.92 0 top
R282  10K  [RN0804]  102.23,102.11 180 top
R291  10K  [RN0804]  102.23,77.72 0 top
R301  1K  [R0402]  17.27,70.36 270 top
R302  1K  [R0402]  16.26,70.36 270 top
R303  1K, DNI  [R0402]  18.29,64.14 270 top
R304  1K, DNI  [R0402]  15.24,70.36 270 top
R305  150, 1%  [R0805]  16.56,66.04 90 top
R401  1K  [R0402]  17.53,108.58 270 top
R402  1K  [R0402]  22.1,108.58 270 top
R801  1K  [R0402]  109.22,4.83 90 top
R802  1K  [R0402]  107.19,4.83 90 top
R901  1.5K, 1% DNI  [R0402]  77.47,9.14 0 top
R902  1.5K, 1% DNI  [R0402]  77.47,7.11 0 top
RTC1  DS3231MZ+  [SO08]  66.93,72.39 270 top
S1  KMR231GLFS  [SW4SMD_63X161LS]  5.84,107.44 0 top
S2  KMR231GLFS  [SW4SMD_63X161LS]  13.21,107.44 0 top
S11  [P101]  114.81,94.23 180 top
S12  [P101]  114.81,104.9 180 top
S13  [DS-04]  114.81,82.8 90 top
T4  DA2304-AL  [DA230X-AL]  27.94,114.3 90 top
TP1  TPB0,65  [TP_B0,65]  57.15,82.55 0 bottom
TP2  TPB0,65  [TP_B0,65]  58.42,82.55 0 bottom
TP3  TPB0,65  [TP_B0,65]  62.23,82.55 0 bottom
TP4  TPB0,65  [TP_B0,65]  63.5,82.55 0 bottom
TP5  TESTPAD/W_HOLE_1X1  [TESTPAD/W_HOLE_1X1]  91.44,104.14 270 top
TP6  TESTPAD/W_HOLE_1X1  [TESTPAD/W_HOLE_1X1]  91.44,106.68 270 top
TP7  TESTPAD/W_HOLE_1X1  [TESTPAD/W_HOLE_1X1]  93.98,104.14 270 top
TP8  TESTPAD/W_HOLE_1X1  [TESTPAD/W_HOLE_1X1]  93.98,106.68 270 top
TP9  TESTPAD/W_HOLE_1X1  [TESTPAD/W_HOLE_1X1]  35.56,63.5 90 top
TP10  TESTPAD/W_HOLE_1X1  [TESTPAD/W_HOLE_1X1]  35.56,60.96 90 top
TP11  TPB0,65  [TP_B0,65]  68.58,93.98 0 bottom
TP12  TPB0,65  [TP_B0,65]  68.58,91.44 0 bottom
TP13  TPB0,65  [TP_B0,65]  63.5,97.79 0 bottom
TP14  TPB0,65  [TP_B0,65]  67.31,88.9 0 bottom
TP15  TPB0,65  [TP_B0,65]  59.69,86.36 0 bottom
TP16  TPB0,65  [TP_B0,65]  58.42,88.9 0 bottom
TP17  TESTPAD/W_HOLE_1X1  [TESTPAD/W_HOLE_1X1]  52.58,63.5 0 top
TP18  TESTPAD/W_HOLE_1X1  [TESTPAD/W_HOLE_1X1]  52.58,60.96 0 top
TP19  TESTPAD/W_HOLE_1X1  [TESTPAD/W_HOLE_1X1]  66.67,64.77 0 top
TP20  TESTPAD/W_HOLE_1X1  [TESTPAD/W_HOLE_1X1]  66.67,62.23 0 top
TP21  TPB0,65  [TP_B0,65]  60.96,97.79 0 bottom
TP22  TPB0,65  [TP_B0,65]  64.77,97.79 0 bottom
TP23  TPB0,65  [TP_B0,65]  68.58,92.71 0 bottom
TP24  TPB0,65  [TP_B0,65]  68.58,90.17 0 bottom
TP26  TPB0,65  [TP_B0,65]  62.23,97.79 0 bottom
TP31  TPB0,65  [TP_B0,65]  19.81,102.36 0 bottom
TP32  TPB0,65  [TP_B0,65]  49.53,87.63 0 bottom
TP33  TPB0,65  [TP_B0,65]  69.85,95.25 0 bottom
U1  OSD3358-512M-ICB  [OSD335X-BGA-400]  60.96,90.17 270 top
U2  TPD4S012_DRY_6_P1_M  [DRY6]  10.41,101.47 180 top
U4  APX811-31UGSOT  [SOT143-R]  15.47,103.61 180 top
U5  TLVH431  [SOT23-3]  64.77,88.9 270 bottom
U6  SN74LVC2G241_DCU_8  [DCU8]  50.8,67.94 0 top
U16  AT97SC3205T-G3M4400B  [QFN32-0.4-4X4MM]  44.45,61.85 0 top
U27  LAN8710  [LAN8710A-QFN32]  35.56,80.64 0 top
U28  TCAN1051HV  [BEAGLEBONE_BLUE_D8]  97.79,6.35 0 top
U29  MAX3483EESA+T  [21-0041B_8]  24.13,66.04 180 top
U40  ISO3086TDW  [DW16]  45.72,114.3 90 top
U$2  [XYZ-LABEL]  60.96,0.64 0 top
VREG1  LM2596S-5.0  [TO263-5]  73.15,118.11 0 top
VREG2  L7824CV  [78XXL]  85.72,113.92 0 top
VREG4  TPS76350  [DBV5]  36.7,119.13 0 top
X1  10118194-0001LF  [10118194-0001LF(MICRO-USB-B-AMPHENOL-FCI)]  1.45,101.6 180 bottom
X2  J0011D01BNL  [J0011D01BNL]  7.87,83.82 90 top
X3  MC4  [MC4]  8.13,65.02 270 top
X4  CTI-JTAG  [CTI-JTAG]  78.74,68.58 0 top
X5  DM3CS-SF  [DM3CS-SF]  24.13,96.27 270 top
X6  6p-2.54  [H6-2.54]  20.32,60.96 270 top
X7  TH-2X10  [H2X10-2.54]  92.71,90.17 0 top
X8  TH-2X10  [H2X10-2.54]  88.9,13.97 270 top
X9  5600200420  [5600200420]  65.53,10.16 270 top
X10  MC4  [MC4]  8.13,48.01 270 top
X11  MC4  [MC4]  8.13,30.99 270 top
X12  MC4  [MC4]  8.13,13.97 270 top
X21  MC12  [MC12]  113.79,44.32 90 top
X24  MSTBA2  [MSTBA2]  116.84,116.84 90 top
X31  MC4  [MC4]  113.79,13.97 90 top
X41  MSTBA3  [MSTBA3]  5.08,118.11 270 top
Y7  ECS-250-12-30-GN-TR  [XTAL_2-SMD(5X3.2MM)]  35.56,72.64 180 top

## Tracks (layer width: path | path; a pad name or v marks a point on that pad's centre or on a via)
1P8V_REF_1  (via drill 0.3)
  Top 0.305: v28.98,50.42 R212.2 | v28.98,42.8 R222.2 | v28.98,33.4 R232.2 | v28.98,25.78 R242.2
  Bottom 0.305: v51.44,43.23 29.41,43.23 v28.98,42.8 | v28.98,50.42 30.33,49.07 50.16,49.07 51.44,47.8 v51.44,46.46 | v28.98,33.4 30.33,32.05 50.16,32.05 51.44,30.79 v51.44,29.44 | v51.44,26.21 29.41,26.21 v28.98,25.78
  pour Top: 56.52,32.84 56.52,46.84 56.26,47.09 51.05,47.09 50.8,46.84 50.8,42.85 51.05,42.6 54.61,42.6 54.86,42.34 54.86,30.33 54.61,30.07 51.05,30.07 50.8,29.82 50.8,25.83 51.05,25.58 54.61,25.58 54.86,25.32 54.86,18.95 55.12,18.69 59.79,18.69 60.05,18.44 60.05,15.93 60.3,15.67 62.36,15.67 62.61,15.93 62.61,19.76 61.34,21.03 58.04,21.03 57.78,21.29 57.78,31.57
1P8V_REF_2  (via drill 0.3)
  Top 0.305: R262.2 v28.98,8.76 | v28.98,16.38 R252.2
  Bottom 0.305: v28.98,8.76 29.41,9.2 v51.44,9.2 | v28.98,16.38 30.33,15.04 50.16,15.04 51.44,13.77 v51.44,12.42
  pour Top: 51.05,8.56 60.68,8.56 60.93,8.81 60.93,12.8 60.68,13.06 51.05,13.06 50.8,12.8 50.8,8.81
5V_OUT
  pour Top (rank 2, no thermals): 72.06,114.45 72.06,109.75 71.78,109.47 65.51,109.47 65.1,109.07 65.1,107.95 64.85,107.7 61.34,107.7 60.71,108.33 60.71,126.75 60.96,127 66.17,127 66.8,126.36 66.8,115.13 67.12,114.81 71.7,114.81
24LIN_IN
  Top 0.508: VREG2.IN C105.1
  Bottom 1.524: J24.1 98.42,112.45 97.79,113.08 83.82,113.08 83.19,112.45 VREG2.IN
24VAC
  pour Top (no thermals): 108.71,107.7 108.94,107.7 109.19,107.95 109.19,110.49 108.94,110.74 106.38,110.74 106.12,110.49 106.12,107.7 105.41,107.7 105.16,107.44 105.16,103.84 105.41,103.58 108.46,103.58 108.71,103.84
24VAC_IN
  pour Bottom (no thermals): 104.6,107.92 104.6,110.36 105.23,111 114.94,111 115.57,111.63 115.57,116.2 114.94,116.84 103.38,116.84 103.12,116.59 103.12,112.78 102.49,112.14 100.84,112.14 100.58,111.89 100.58,107.92 100.84,107.67 104.34,107.67
  pour Route15 (isolate 0.254, rank 2, no thermals): 115.57,116.2 115.57,111.63 114.94,111 104.39,111 103.12,112.27 103.12,125.09 100.58,127.64 6.99,127.64 6.35,127 6.35,61.85 6.99,61.21 10.36,61.21 11,60.58 11,57.78 10.36,57.15 0.76,57.15 0.13,57.78 0.13,129.41 105.92,129.41 107.19,128.14 107.19,117.47 107.82,116.84 114.94,116.84
24VDC_AUX  (via drill 0.3)
  Top 0.203: VREG2.OUT 90.81,110.11 91.44,110.74 91.44,126.24 92.08,126.87 D19.1
  Top 0.508: VREG2.OUT C106.1
  Bottom 1.524: X31.4 110.67,19.68 109.02,18.03 89.63,18.03 87.63,16.03 | X8.19 77.47,16.03 79.47,18.03 85.63,18.03 87.63,16.03 | 87.63,16.03 X8.11
  other vias: 97.54,65.53 96.52,64.52 95.5,64.52 97.54,64.52 98.55,65.53 98.55,64.52
  pour Bottom: 97.41,104.14 99.57,104.14 99.82,103.89 99.82,100.33 99.57,100.08 97.54,100.08 97.28,99.82 97.28,66.29 97.54,66.04 98.81,66.04 99.06,65.79 99.06,64.39 98.81,64.14 95.5,64.14 95.25,64.39 95.25,107.31 94.61,107.95 87.17,107.95 86.92,108.2 86.92,111.76 87.17,112.01 96.52,112.01 97.16,111.38 97.16,104.39
  pour Top: 98.17,59.44 108.33,59.44 108.97,58.8 108.97,18.41 109.6,17.78 116.89,17.78 117.53,18.41 117.53,20.95 116.89,21.59 111.89,21.59 111.25,22.23 111.25,61.09 110.62,61.72 99.69,61.72 99.06,62.36 99.06,65.79 98.81,66.04 95.5,66.04 95.25,65.79 95.25,32.13 95.89,31.5 96.9,31.5 97.54,32.13 97.54,58.8
  pour Top: 73.15,56.52 73.15,14.61 73.79,13.97 77.6,13.97 78.23,14.61 78.23,15.88 77.6,16.51 76.07,16.51 75.44,17.14 75.44,56.52 74.8,57.15 73.79,57.15
24VDC_UNREG  (via drill 0.3)
  other vias: 68.58,111.76 68.58,112.78 68.58,110.74 97.03,115.32 97.03,114.3 98.04,114.3 98.04,115.32 98.04,116.33 97.03,116.33 67.56,112.78 66.55,112.78
  pour Top (no thermals): 65.91,110.46 70.1,110.46 70.36,110.72 70.36,113.16 70.1,113.41 65.91,113.41 65.66,113.16 65.66,110.72
  pour Bottom: 65.91,110.46 81.53,110.46 81.79,110.72 81.79,112.52 83.06,113.79 101.47,113.79 101.73,114.05 101.73,116.59 101.47,116.84 65.91,116.84 65.66,116.59 65.66,110.72
  pour Top (isolate 0.305, no thermals): 104.6,103.84 104.6,107.42 104.34,107.67 100.84,107.67 100.58,107.92 100.58,110.74 100.84,111 103.96,111 104.6,111.63 104.6,116.59 104.34,116.84 96.52,116.84 96.27,116.59 96.27,103.84 96.52,103.58 104.34,103.58
41_A
  Bottom 1.524: X41.2 13.46,118.11 14.73,116.84 GDT1.1
  pour Top: 16.51,111 16.51,115.06 17.32,115.87 18.24,115.87 18.49,116.13 18.49,118.49 18.24,118.75 13.59,118.75 13.34,118.49 13.34,111 13.59,110.74 16.26,110.74
41_B
  Bottom 1.524: X41.1 13.46,123.19 14.73,124.46 GDT1.2
  pour Top (rank 3): 23.34,123.7 18.75,123.7 18.49,123.44 18.49,122.81 18.24,122.56 13.59,122.56 13.34,122.81 13.34,126.75 13.59,127 23.6,127 23.6,123.95
485_A
  Top 0.152: R304.2 15.24,69.04 16.51,67.77 16.51,66.93
  Top 0.254: 12.34,65.99 D305.1 | R305.2 16.51,66.93
  Top 0.305: X3.2 10.57,66.93 11.51,65.99 12.34,65.99 14.45,65.99 15.39,66.93 16.51,66.93 | U29.6 16.82,66.67 R305.2
485_B
  Top 0.152: R303.1 17.02,64.69 R305.1
  Top 0.254: 12.32,64.08 D305.2 12.35,64.08
  Top 0.305: X3.3 10.54,63.12 11.51,64.08 12.32,64.08 | U29.7 16.82,65.41 R305.1 15.49,64.08 12.35,64.08
485_RXD
  Top 0.152: J45.1 42.55,96.01 45.72,96.01 46.35,96.65 U40.5 46.35,111.51 45.72,112.14 23.64,112.14 D402.2
485_TXD
  Top 0.152: J45.2 46.35,94.74 46.99,95.38 46.99,105.79 47.62,106.43 49.53,106.43 50.16,107.06 U40.8 49.78,109.78 49.53,109.53 49.53,108.1 49.25,107.82 47.3,107.82 46.99,108.13 46.99,111.81 46.35,112.45 23.5,112.45 21.03,109.98 19.44,109.98 D401.2
AGND  (via drill 0.3)
  Top 0.152: v59.66,74.42 59.31,74.07 R25.2
  Top 0.254: C9.2 C8.2 v64.06,62.71 | v62.94,67.33 C10.2
  Top 0.305: 47.62,17.13 IC12.4 | IC10.4
  Top 0.508: v59.66,75.95 59.05,76.56 U1.Y9
  other vias: 59.11,75.18 47.62,52.78 47.62,35.76 47.62,18.75 53.75,37.85 53.75,54.86 53.75,54.1 33.78,54.86 33.78,54.1 28.98,52.45 28.98,44.83 28.98,35.43 28.98,27.81 28.98,18.41 28.98,10.79 45.69,41.91 45.69,41.15 53.75,37.08 45.69,24.89 45.69,24.13 45.69,7.87 45.69,7.09 53.75,20.83 53.75,20.07 33.78,47.24 33.78,46.48 33.78,37.85 33.78,37.08 33.78,30.23 33.78,29.46 33.78,20.83 33.78,20.07 33.78,13.21 33.78,12.45 57.15,55.88 57.15,51.82 57.15,48.01 57.15,44.2 57.15,34.8 6.35,55.88 6.35,51.82 6.35,48.01 6.35,44.2 6.35,39.5 6.35,34.8 6.35,30.99 6.35,27.18 6.35,22.48 6.35,17.78 6.35,13.97 6.35,10.16 6.35,6.35 57.15,39.5 57.15,6.35 15.49,6.35 17.53,6.35 16.51,6.35
  pour Top: 59.87,76.45 59.87,73.91 58.9,73.91 58.9,76.45
  pour Route2 (isolate 0.254): 58.27,63.07 58.27,80.01 58.9,80.64 62.87,80.64 63.5,80.01 63.5,68.88 64.8,67.59 64.8,6.38 64.14,5.71 40.64,5.71 40.64,7.24 38.99,8.89 33.4,8.89 31.75,7.24 31.75,5.71 6.35,5.71 5.71,6.35 5.71,55.88 6.35,56.52 51.71,56.52
  pour Top (isolate 0.254, rank 2): 6.35,56.52 57.15,56.52 57.78,55.88 57.78,6.35 57.15,5.71 40.64,5.71 40.64,7.24 38.99,8.89 33.4,8.89 31.75,7.24 31.75,5.71 6.35,5.71 5.71,6.35 5.71,55.88
  pour Bottom: 15.19,6.6 15.19,3.05 15.44,2.79 17.53,2.79 17.78,3.05 17.78,6.6 17.53,6.86 15.44,6.86
AIN1  (via drill 0.3)
  Top 0.152: U1.W10 59.84,78.89 59.84,77.37 60.5,76.71 60.5,53.39 v60.2,53.09
  Top 0.305: IC10.2 IC10.1 v51.44,52.78 50.55,53.67 R215.1
  Bottom 0.152: v60.2,53.09 59.89,52.78 v51.44,52.78
AIN2  (via drill 0.3)
  Top 0.152: v59.13,45.16 59.44,45.47 59.44,69.16 60.2,69.93 60.2,76.58 59.54,77.24 59.54,79.86 U1.V10
  Top 0.305: IC10.6 48.95,44.85 | 48.95,44.85 IC10.7 v50.16,46.46 | R225.1 48.9,44.8 48.95,44.85
  Bottom 0.152: v59.13,45.16 58.83,44.86 51.77,44.86 v50.16,46.46
AIN3  (via drill 0.3)
  Top 0.152: U1.V9 58.27,79.86 58.27,36.35 v57.99,36.07
  Top 0.305: IC11.2 51.41,34.14 | 51.41,34.14 IC11.1 | 51.41,34.14 51.44,34.17 v51.44,35.76 50.55,36.65 R235.1
  Bottom 0.152: v57.99,36.07 57.68,35.76 v51.44,35.76
AIN4  (via drill 0.3)
  Top 0.152: U1.Y11 61.59,28.57 v61.21,28.19
  Top 0.305: IC11.6 48.92,27.83 | 48.92,27.83 IC11.7 v50.16,29.44 | R245.1 48.9,27.81 48.92,27.83
  Bottom 0.152: v50.16,29.44 51.77,27.84 60.86,27.84 v61.21,28.19
AIN5  (via drill 0.3)
  Top 0.152: U1.W11 61.11,78.89 61.11,28.98 60.45,28.32 v60.45,25.65
  Top 0.305: IC12.2 IC12.1 v51.44,18.75 50.55,19.63 R255.1
  Bottom 0.152: v60.45,25.65 53.54,18.75 v51.44,18.75
AIN6  (via drill 0.3)
  Top 0.152: U1.V11 60.81,79.86 60.81,29.57 59.69,28.45 v59.69,23.11
  Top 0.305: v50.16,12.42 IC12.7 48.92,10.82 | 48.92,10.82 IC12.6 | R265.1 48.9,10.79 48.92,10.82
  Bottom 0.152: v50.16,12.42 51.46,11.12 52.6,11.12 53.98,12.5 53.98,17.4 v59.69,23.11
AIN7
  Top 0.152: U1.U12 U1.V12
B03_NO
  Bottom 1.524: X21.6 111.45,44.32 107.77,40.64 82.47,40.64 77.78,35.94 73.08,35.94 70.57,33.43 K3.NO
B_UART0_RX
  Top 0.152: U6.2 47.57,68.2 R27.2 47.42,68.2 30.86,68.2 29.21,66.55 29.21,60.96 27.94,59.69 20.32,59.69 X6.4
B_UART0_TX
  Top 0.152: U6.3 30.99,67.69 29.72,66.42 29.72,60.83 28.07,59.18 18.29,59.18 X6.5
BAT_SENSE
  Top 0.152: U1.E19 72.54,97.94 77.06,97.94 79.12,100 86.39,100 86.94,100.56 86.94,102.18 TP6.P$1
BO1  (via drill 0.3)
  Top 0.254: R171.2 97.28,50.85 v97.28,49.28 | X8.10 88.85,11.38 81.92,11.38 81.28,12.01 81.28,37.28 K1.2
  Bottom 0.254: K1.2 81.27,43.28 87.27,49.28 v97.28,49.28
BO1_AUTO
  Top 0.254: IC2.16 94.36,74.3 91.69,71.63 91.69,16.99 90.17,15.47 X8.9
BO1_C
  Bottom 1.524: X21.11 112.32,63.37 109.02,60.07 83.33,60.07 78.82,55.56 78.82,50.81 K1.C
BO1_NC
  Bottom 1.524: X21.10 112.39,59.56 110.62,57.78 84.28,57.78 81.1,54.61 81.1,48.34 78.56,45.8 72.36,45.8 69.84,43.28 K1.NC
BO1_NO
  Bottom 1.524: X21.12 106.22,67.18 101.4,62.36 82.37,62.36 77.8,57.78 73.03,57.78 70.52,55.28 K1.NO
BO2
  Top 0.254: R172.2 101.22,46.99 K2.2 99.72,41.06 99.72,31.9 94.74,26.92 94.74,20.83 96.77,18.8 101.09,18.8 102.87,17.02 102.87,15.24 101.6,13.97 93.98,13.97 X8.8
BO2_AUTO
  Top 0.254: IC2.15 94.39,73.03 92.2,70.84 92.2,16.99 92.71,16.48 X8.7
BO2_C
  Bottom 1.524: X21.8 111.96,51.94 109.3,49.28 K2.C
BO2_NC
  Bottom 1.524: K2.NC 88.79,46.76 110.47,46.76 111.84,48.13 X21.7
BO2_NO
  Bottom 1.524: X21.9 112.17,55.75 108.2,51.79 88.79,51.79 K2.NO
BO3  (via drill 0.3)
  Top 0.254: v95.5,22.86 95.5,26.21 R173.2 | X8.6 92.58,10.03 80.01,10.03 78.74,11.3 78.74,17.97 K3.2
  Bottom 0.254: X8.6 95.28,12.7 | v95.5,22.86 92.2,19.56 77.15,19.56 K3.2
BO3_AUTO
  Top 0.254: IC2.14 94.44,71.75 92.71,70.03 92.71,17.78 X8.5
BO3_C
  Bottom 1.524: X21.5 111.51,40.51 109.35,38.35 83.44,38.35 78.82,33.73 78.82,28.97 K3.C
BO3_NC
  Bottom 1.524: X21.4 112.42,36.7 111.78,36.07 84.4,36.07 81.1,32.77 81.1,26.49 78.56,23.95 72.48,23.95 69.96,21.43 K3.NC
BO4
  Top 0.254: K4.2 100.2,24.13 R174.2 103.38,22.66 103.38,12.65 102.11,11.38 99.11,11.38 X8.4
BO4_AUTO
  Top 0.254: IC2.13 94.46,70.48 93.22,69.24 93.22,18.54 95.25,16.51 96.52,16.51 X8.3
BO4_C
  Bottom 1.524: X21.2 112.29,29.08 110.64,27.43 K4.C
BO4_NC
  Bottom 1.524: K4.NC 88.79,24.92 112.24,24.92 112.6,25.27 X21.1
BO4_NO
  Bottom 1.524: X21.3 111.91,32.89 108.97,29.95 88.79,29.95 K4.NO
BO5_AUTO
  Top 0.254: IC2.12 94.46,69.22 93.73,68.48 93.73,19.3 95.76,17.27 98.3,17.27 X8.1
BO6_AUTO  (via drill 0.3)
  Top 0.254: IC2.11 94.74,67.94 94.23,67.44 94.23,20.07 96.29,18.01 100.61,18.01 v102.11,16.51
  Bottom 0.254: X8.12 88.95,11.38 100.99,11.38 102.11,12.5 v102.11,16.51
CAN1_RXD  (via drill 0.3)
  Top 0.152: U1.W7 56.52,79.35 56.03,78.87 v56.03,61.85 | v67.31,58.93 v67.31,19.43 | v93.47,4.45 U28.4 97.61,4.45 98.63,3.43 105.66,3.43 106.17,3.94 106.17,8.36 106.95,9.13 D802.2
  Bottom 0.152: v56.03,61.85 58.95,58.93 v67.31,58.93 | v67.31,19.43 67.31,10.87 68.58,9.6 88.32,9.6 v93.47,4.45
CAN1_TXD  (via drill 0.3)
  Top 0.152: U1.Y7 56.52,62.89 v56.79,62.61 | v68.58,58.93 v68.58,19.43 | v93.47,8.26 U28.1 | v110.36,8.26 109.49,9.13 D801.2
  Bottom 0.152: v56.79,62.61 59.36,60.05 67.46,60.05 v68.58,58.93 | v68.58,19.43 68.58,11.99 69.85,10.72 91.01,10.72 v93.47,8.26 v110.36,8.26
CAN_H
  Top 0.305: X31.3 111.17,15.88 D805.2 105.59,14.92 104.32,13.65 104.32,7.62 103.68,6.99 U28.7
CAN_L
  Top 0.305: X31.2 111.17,12.06 D805.1 106.17,13.02 105.54,12.38 105.54,6.99 104.27,5.71 U28.6
CGND  (via drill 0.3)
  Top 0.305: v36.83,95.71 36.83,94.72 X5.11 | v36.83,100.74 X5.13
  Bottom 0.305: v36.83,100.74 v36.83,95.71
  Bottom 0.813: X2.S2 22.25,91.69 v22.81,92.25
  other vias: 22.81,93.17
  pour Top (rank 6): 5.71,56.52 -5.08,56.52 -5.08,-5.08 127,-5.08 127,56.52 120.65,56.52 120.65,6.35 120.02,5.71 113.67,5.71 113.03,5.08 113.03,2.54 112.39,1.91 90.17,1.91 89.53,2.54 89.53,6.99 88.27,8.26 83.19,8.26 81.92,6.99 81.92,2.54 81.28,1.91 40.64,1.91 40.01,2.54 40.01,6.99 38.73,8.26 33.66,8.26 32.38,6.99 32.38,2.54 31.75,1.91 15.24,1.91 14.61,2.54 14.61,5.08 13.97,5.71 6.35,5.71 5.71,6.35
  pour Bottom (rank 6): -1.27,56.52 5.71,56.52 5.71,73.41 6.35,74.04 11.56,74.04 12.83,75.31 12.83,76.58 11.56,77.85 10.64,77.85 8.86,76.07 6.91,76.07 5.71,77.27 5.71,98.73 5.08,99.36 3.05,99.36 3.05,103.81 5.08,103.81 5.71,104.44 5.71,127 6.35,127.64 31.75,127.64 32.38,127 32.38,122.56 33.66,121.28 38.73,121.28 40.01,122.56 40.01,127 40.64,127.64 79.76,127.64 80.39,127 80.39,121.67 81.66,120.4 89.79,120.4 91.06,121.67 91.06,127 91.69,127.64 112.39,127.64 113.03,127 113.03,121.28 115.57,118.75 120.02,118.75 120.65,118.11 120.65,56.52 123.19,56.52 123.19,130.81 -1.27,130.81
  pour Bottom (rank 6): 5.71,56.52 -1.27,56.52 -1.27,-1.27 123.19,-1.27 123.19,56.52 120.65,56.52 120.65,6.35 120.02,5.71 113.67,5.71 113.03,5.08 113.03,2.54 112.39,1.91 90.17,1.91 89.53,2.54 89.53,6.99 88.27,8.26 83.19,8.26 81.92,6.99 81.92,2.54 81.28,1.91 40.64,1.91 40.01,2.54 40.01,6.99 38.73,8.26 33.66,8.26 32.38,6.99 32.38,2.54 31.75,1.91 15.24,1.91 14.61,2.54 14.61,5.08 13.97,5.71 6.35,5.71 5.71,6.35 5.71,55.85 5.71,55.85
  pour Top: -5.08,56.52 5.71,56.52 5.71,71.37 5.08,72.01 2.54,72.01 1.27,73.28 1.27,90.3 2.54,91.57 8.86,91.57 10.64,89.79 11.56,89.79 12.83,91.06 12.83,92.33 11.56,93.6 1.91,93.6 1.27,94.23 1.27,127 1.91,127.64 31.75,127.64 32.38,127 32.38,122.56 33.66,121.28 38.73,121.28 40.01,122.56 40.01,127 40.64,127.64 81.28,127.64 81.92,127 81.92,122.56 83.19,121.28 88.27,121.28 89.53,122.56 89.53,127 90.17,127.64 112.39,127.64 113.03,127 113.03,121.28 115.57,118.75 120.02,118.75 120.65,118.11 120.65,56.52 127,56.52 127,134.62 -5.08,134.62
  pour Top: 22.86,95.53 22.86,104.65 23.11,104.9 26.16,104.9 26.42,105.16 26.42,106.78 26.16,107.04 21.08,107.04 20.83,106.78 20.83,91.69 21.08,91.44 26.16,91.44 26.42,91.69 26.42,93.22 26.67,93.47 37.85,93.47 38.1,93.73 38.1,95.02 37.85,95.28 23.11,95.28
  pour Bottom: 20.83,93.22 20.83,91.69 21.08,91.44 23.62,91.44 23.88,91.69 23.88,93.22 23.62,93.47 21.08,93.47
CLKOUT2
  Top 0.152: X4.18 79.2,64.14 78.56,64.77 74.24,64.77 73.61,65.41 72.9,65.41 | 72.9,65.41 C2.2 | R3.2 72.9,65.41
CRS
  Top 0.152: ER124.1 43.1,81.99 39.85,81.99 39.26,81.4 U27.14
E_LED_GRN  (via drill 0.3)
  Top 0.152: X2.9 2.34,90.14 1.7,89.51 1.7,73.38 2.72,72.36 30.38,72.36 31.24,73.23 31.24,74.78 v32.23,75.77 | U27.3 34.81,77.28 v34.77,77.24
  Bottom 0.152: v32.23,75.77 32.38,75.92 33.96,75.92 34.77,76.73 v34.77,77.24
E_LED_YEL  (via drill 0.3)
  Top 0.152: X2.12 4.56,75.08 5.19,74.45 28.17,74.45 ER120.2 29.18,75.46 31.04,75.46 v31.34,75.77 | U27.2 34.31,77.56 34.09,77.34 v34.09,76.89
  Bottom 0.152: v31.34,75.77 31.9,76.33 33.53,76.33 v34.09,76.89
EEPROM_WP  (via drill 0.3)
  Top 0.152: U1.M2 49.53,88.9 48.56,88.9 48.06,89.41 35.26,89.41 32.51,86.67 32.51,83.19 v32.28,82.96
  Bottom 0.152: v32.28,82.96 31.29,82.96 30.02,81.69 30.02,73.13 31.39,71.75 47.62,71.75 J1.1
EHRPWM1A  (via drill 0.3)
  Top 0.152: U1.C13 v64.77,100.33 | X8.15 86.72,19.41 86.72,69.37 85.72,70.36 v84.58,70.36
  Bottom 0.152: v64.77,100.33 64.77,99.49 65.94,98.32 69.77,98.32 75.06,93.04 75.06,76.81 78.21,73.66 81.28,73.66 v84.58,70.36
EHRPWM1B  (via drill 0.3)
  Top 0.152: U1.A12 v63.5,102.87
EHRPWM2A  (via drill 0.3)
  Top 0.152: U1.A17 v69.85,102.87 | v82.58,76.05 87.02,71.6 87.02,18.24 85.09,16.31 X8.13
  Bottom 0.152: v69.85,102.87 69.85,101.3 77.22,93.93 77.22,77.67 78.84,76.05 v82.58,76.05
EHRPWM2B  (via drill 0.3)
  Top 0.152: v68.58,100.38 67.94,99.75 U1.C16 | v84.12,75.77 87.33,72.57 87.33,17.04 86.39,16.1 86.39,13.99 X8.14
  Bottom 0.152: v68.58,100.38 68.81,100.15 70.56,100.15 76.91,93.8 76.91,77.55 78.97,75.49 83.84,75.49 v84.12,75.77
GND  (via drill 0.3, 0.3 pad 0.61)
  Top 0.152: U16.24 46.91,63.25 v47.12,63.04 46.92,62.85 U16.23 | U16.18 46.93,60.85 v47.12,61.04 46.9,61.25 U16.19 | U16.20 46.92,61.65 v47.12,61.85 46.92,62.05 U16.21 | U16.32 43.05,64.06 42.8,64.31 v42.52,64.31 | C22.2 35.41,104.39 32.33,101.32 26.19,101.32 v25.91,101.6 | VREG1.6 v73.15,120.14 | v41.02,60.07 41.17,59.92 43.02,59.92 U16.9 | U16.5 41.99,61.65 v41.78,61.44 41.98,61.25 U16.6 | v41.78,62.99 41.93,62.85 U16.2 | v34.54,80.64 U27.33 | C901.2 75.16,8.13 X9.P$2
  Top 0.203: U1.W13 64.77,78.74 64.77,76.48 67.18,74.07 67.18,71.12 67.82,70.48 RTC1.5